# EAGLE schematic BEP32_12nutzen_stencil (EAGLE 6.4), part 3 of 4
## Sheet 9 of 12
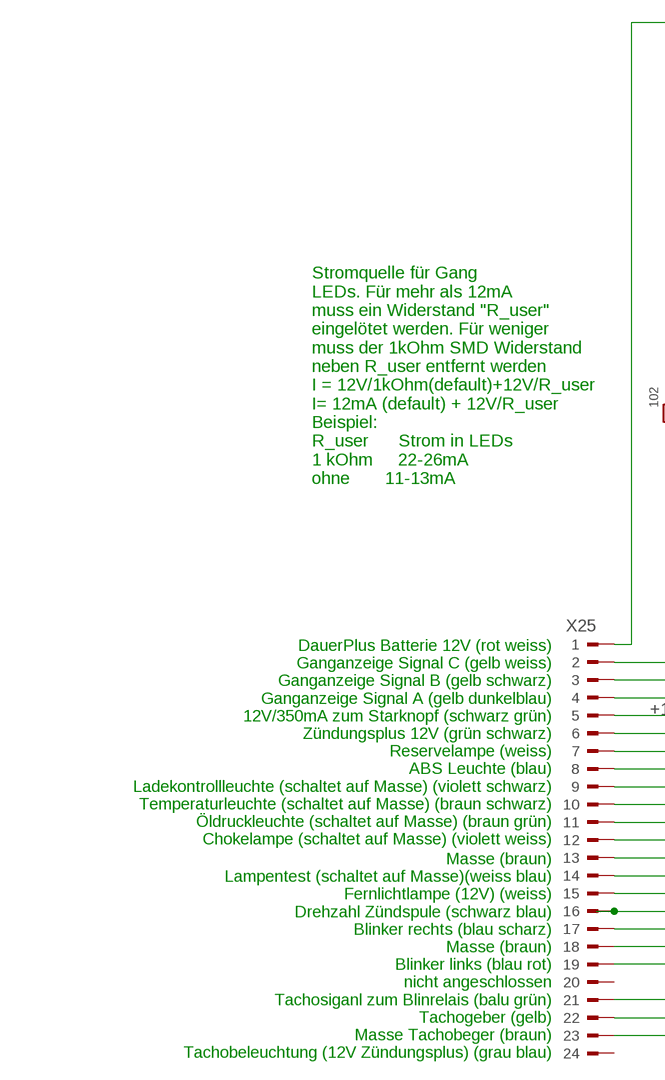
[diagram p16: schematic, sheet 9, part 1 of 2]
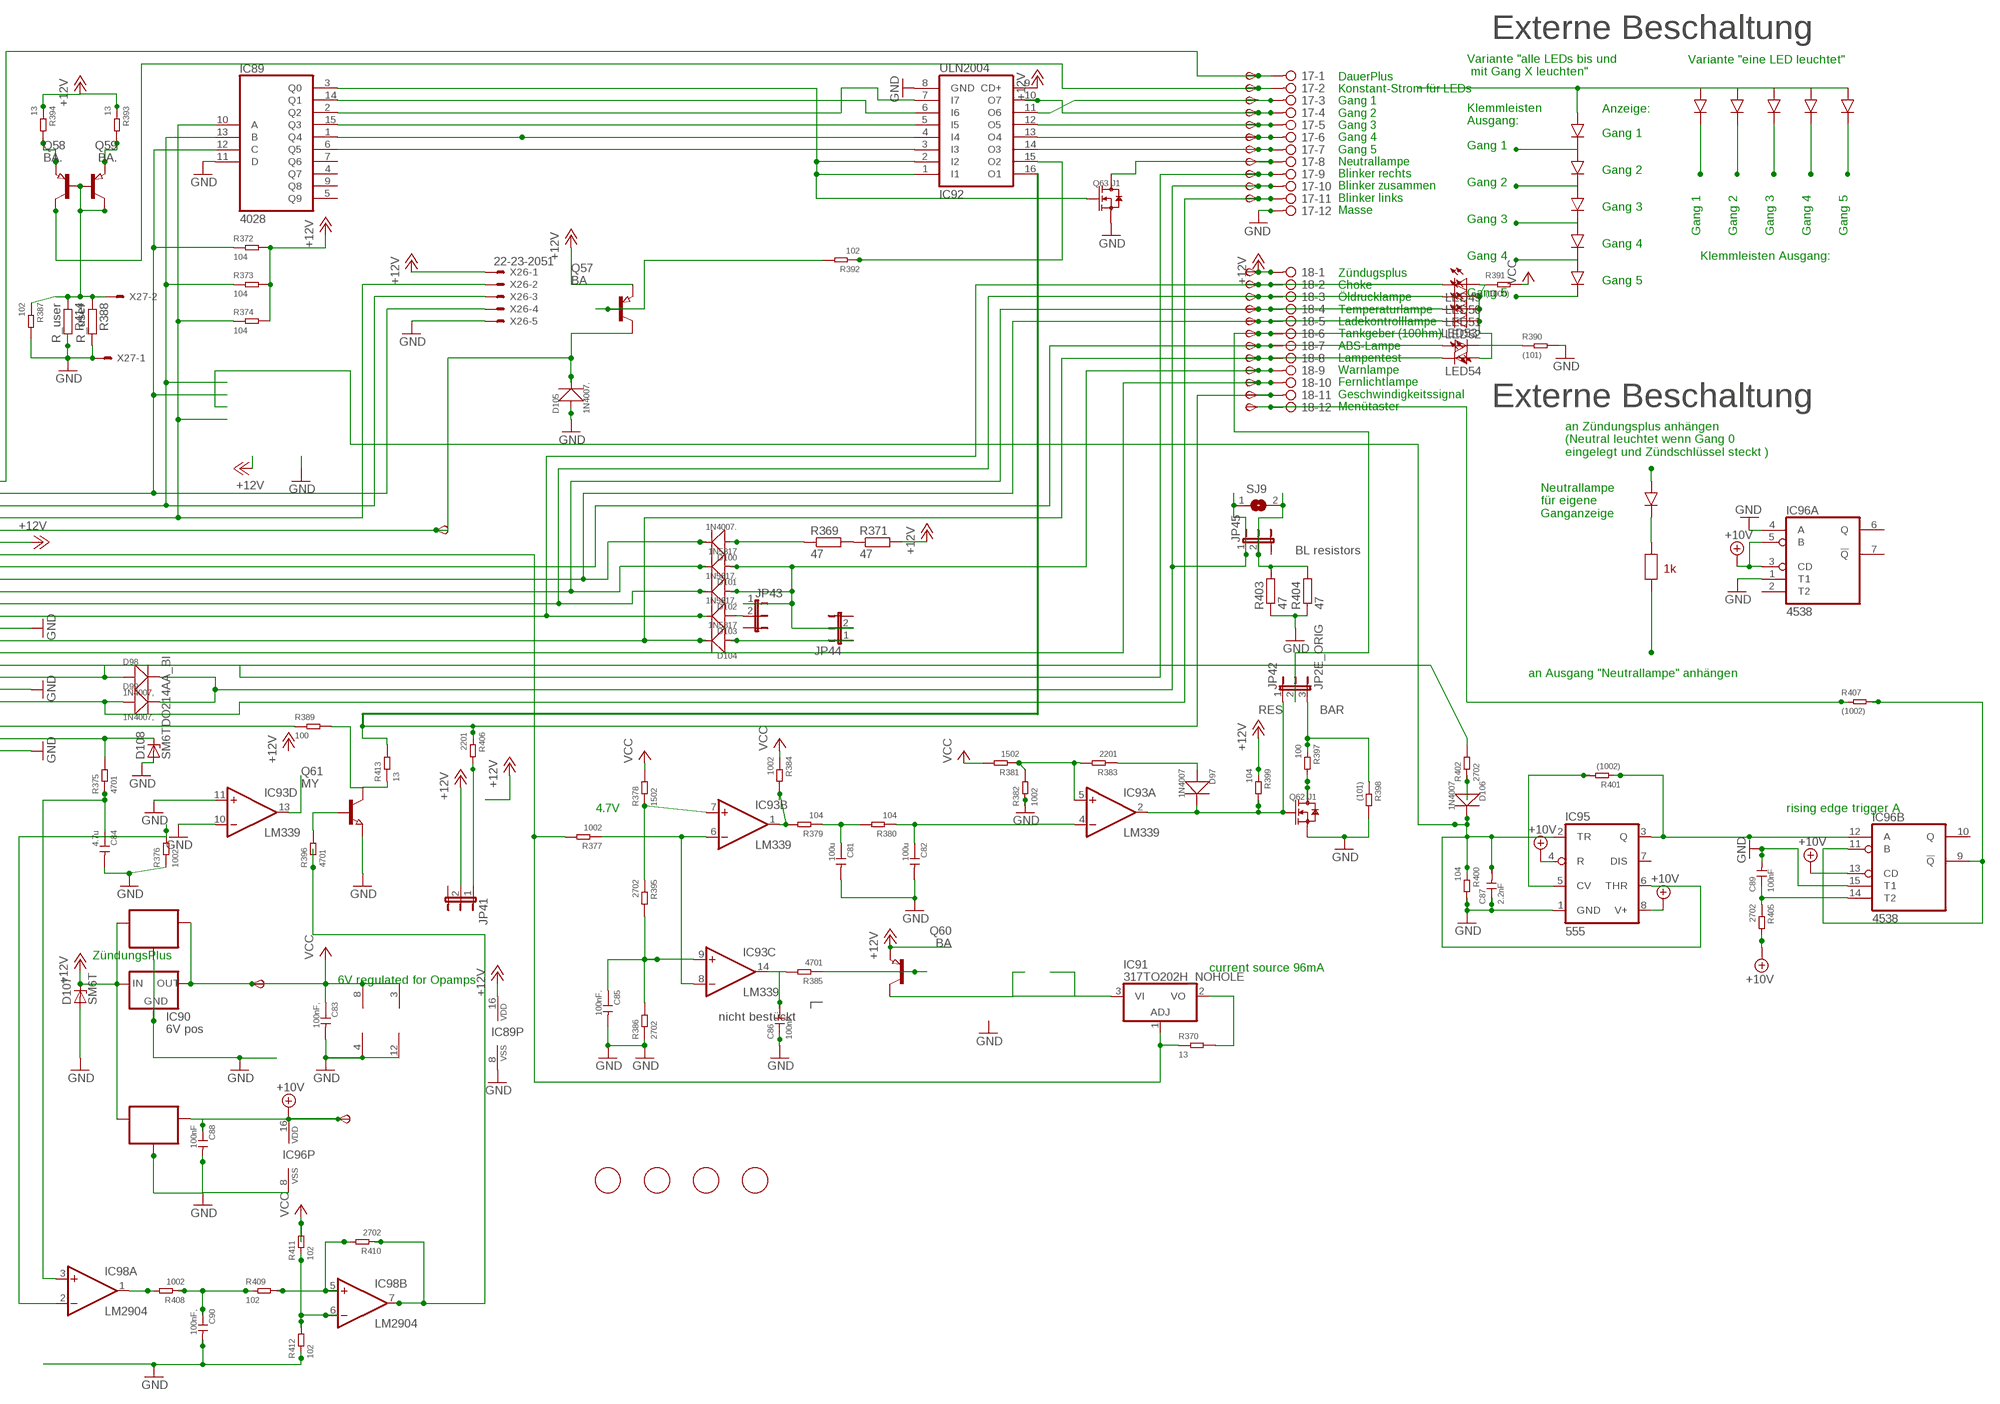
[diagram p17: schematic, sheet 9, part 2 of 2]

### Parts
6V8  TPSB2.0  [B2.0]
10V8  TPSB2.0  [B2.0]
17  2081-1132  [12-PIN]
18  2081-1132  [12-PIN]
C81  100u  CERAMIC-100UF-6.3V-20%-X5R(1206)  [C1206]
C82  100u  CERAMIC-100UF-6.3V-20%-X5R(1206)  [C1206]
C83  100nF,  CERAMIC-100NF-50V-10%-X7R(0805)  [C0805]
C84  4.7u  CERAMIC-4.7UF-25V-10%-X5R(0805)  [C0805]
C85  100nF.  CERAMIC-100NF-50V-10%-X7R(0805)  [C0805]
C86  100nF.  CERAMIC-100NF-50V-10%-X7R(0805)  [C0805]
C87  2.2nF  CERAMIC-100NF-50V-10%-X7R(0805)  [C0805]
C88  100nF  CERAMIC-100NF-50V-10%-X7R(0805)  [C0805]
C89  100nF  CERAMIC-100NF-50V-10%-X7R(0805)  [C0805]
C90  100nF,  CERAMIC-100NF-50V-10%-X7R(0805)  [C0805]
D97  1N4007  DIODE-GEN-PURPOSE-1KV-1A(DO-214AC)  [DO-214AC]
D98  1N4007,  DIODE-GEN-PURPOSE-1KV-1A(DO-214AC)  [DO-214AC]
D99  1N4007,  DIODE-GEN-PURPOSE-1KV-1A(DO-214AC)  [DO-214AC]
D100  1N4007.  DIODE-GEN-PURPOSE-1KV-1A(DO-214AC)  [DO-214AC]
D101  1N5817  DIODE-GEN-PURPOSE-1KV-1A(DO-214AC)DO-214AC/1206  [DO-214AC_SLIM]
D102  1N5817.  DIODE-GEN-PURPOSE-1KV-1A(DO-214AC)DO-214AC/1206  [DO-214AC_SLIM]
D103  1N5817.  DIODE-GEN-PURPOSE-1KV-1A(DO-214AC)DO-214AC/1206  [DO-214AC_SLIM]
D104  1N5817  DIODE-GEN-PURPOSE-1KV-1A(DO-214AC)DO-214AC/1206  [DO-214AC_SLIM]
D105  1N4007.  DIODE-GEN-PURPOSE-1KV-1A(DO-214AC)  [DO-214AC]
D106  1N4007  DIODE-GEN-PURPOSE-1KV-1A(DO-214AC)  [DO-214AC]
D107  SM6T  [DO214AA]
D108  SM6TDO214AA_BI  [DO214AA_BI]
FID33  FIDUCIAL  [FIDUCIAL_1MM]
FID34  FIDUCIAL  [FIDUCIAL_1MM]
FID35  FIDUCIAL  [FIDUCIAL_1MM]
FID36  FIDUCIAL  [FIDUCIAL_1MM]
IC89  4028  4028D  [SO16]
IC90  6V pos  78LXX  [78LXX]
IC91  317TO202H_NOHOLE  [TO220H_NOHOLE]
IC92  ULN2004  ULN2004AD  [SO16]
IC93  LM339  LM339D  [SO14]
IC94  78L06  78LXXSOT89_ROUND  [SOT89_ROUND]
IC95  555  NE555D  [SO08]
IC96  4538  4538D  [SO16]
IC97  78L10  78LXXSOT89_ROUND  [SOT89_ROUND]
IC98  LM2904  LM358D  [SO08]
JP41  JP2EJP2_SMALLPADS  [JP2_SMALLPADS]
JP42  JP2E_ORIG  [JP2_ORIG_SMALLPADS]
JP43  JP2EJP2_SMALLPADS  [JP2_SMALLPADS]
JP44  JP2EJP2_SMALLPADS  [JP2_SMALLPADS]
JP45  JP2EJP2_SMALLPADS  [JP2_SMALLPADS]
LED49  LEDLD260  [LD260]
LED50  LEDLD260  [LD260]
LED51  LEDLD260  [LD260]
LED52  LEDLD260  [LD260]
LED53  LEDLD260  [LD260]
LED54  LEDLD260  [LD260]
Q57  BA  PNP-TRANSISTOR_SOT89  [SOT89]
Q58  BA.  PNP-TRANSISTOR_SOT89  [SOT89]
Q59  BA.  PNP-TRANSISTOR_SOT89  [SOT89]
Q60  BA  PNP-TRANSISTOR_SOT89  [SOT89]
Q61  MY  NPN-TRANSISTOR_SOT89  [SOT89]
Q62  J1  SMD-MOSFET-N-CH-50V-200MA-BSS138W-7-F(SOT-23)  [SOT-23]
Q63  J1  SMD-MOSFET-N-CH-50V-200MA-BSS138W-7-F(SOT-23)  [SOT-23]
R369  47  R-EU_V235/17_1MM  [V235/17_1MM]
R370  13  SMD-RES-13R-5%-1/4W(1206)  [R1206]
R371  47  R-EU_V235/17_1MM  [V235/17_1MM]
R372  104  SMD-RES-10K-1%-1/8W(0805)  [R0805]
R373  104  SMD-RES-10K-1%-1/8W(0805)  [R0805]
R374  104  SMD-RES-10K-1%-1/8W(0805)  [R0805]
R375  4701  SMD-RES-4.7K-5%-1/8W(0805)  [R0805]
R376  1002  SMD-RES-10K-1%-1/8W(0805)  [R0805]
R377  1002  SMD-RES-10K-1%-1/8W(0805)  [R0805]
R378  1502  SMD-RES-10K-1%-1/8W(0805)  [R0805]
R379  104  SMD-RES-10K-1%-1/8W(0805)  [R0805]
R380  104  SMD-RES-10K-1%-1/8W(0805)  [R0805]
R381  1502  SMD-RES-10K-1%-1/8W(0805)  [R0805]
R382  1002  SMD-RES-10K-1%-1/8W(0805)  [R0805]
R383  2201  SMD-RES-2.2K-5%-1/8W(0805)  [R0805]
R384  1002  SMD-RES-10K-1%-1/8W(0805)  [R0805]
R385  4701  SMD-RES-4.7K-5%-1/8W(0805)  [R0805]
R386  2702  SMD-RES-4.7K-5%-1/8W(0805)  [R0805]
R387  102  SMD-RES-1K-5%-1/8W(0805)  [R0805]
R388  R_user  R-EU_R0805  [R0805]
R389  100  SMD-RES-220R-5%-1/8W(0805)  [R0805]
R390  (101)  SMD-RES-100R-5%-1/8W(0805)  [R0805]
R391  (1000)  SMD-RES-100R-5%-1/8W(0805)  [R0805]
R392  102  SMD-RES-1K-5%-1/8W(0805)  [R0805]
R393  13  SMD-RES-13R-5%-1/4W(1206)  [R1206]
R394  13  SMD-RES-13R-5%-1/4W(1206)  [R1206]
R395  2702  SMD-RES-4.7K-5%-1/8W(0805)  [R0805]
R396  4701  SMD-RES-4.7K-5%-1/8W(0805)  [R0805]
R397  100  SMD-RES-2.2K-5%-1/8W(0805)  [R0805]
R398  (101)  SMD-RES-2.2K-5%-1/8W(0805)  [R0805]
R399  104  SMD-RES-10K-1%-1/8W(0805)  [R0805]
R400  104  SMD-RES-10K-1%-1/8W(0805)  [R0805]
R401  (1002)  SMD-RES-10K-1%-1/8W(0805)  [R0805]
R402  2702  SMD-RES-10K-1%-1/8W(0805)  [R0805]
R403  47  R-EU_V235/17_1MM  [V235/17_1MM]
R404  47  R-EU_V235/17_1MM  [V235/17_1MM]
R405  2702  SMD-RES-4.7K-5%-1/8W(0805)  [R0805]
R406  2201  SMD-RES-2.2K-5%-1/8W(0805)  [R0805]
R407  (1002)  SMD-RES-4.7K-5%-1/8W(0805)  [R0805]
R408  1002  SMD-RES-10K-1%-1/8W(0805)  [R0805]
R409  102  SMD-RES-1K-5%-1/8W(0805)  [R0805]
R410  2702  SMD-RES-4.7K-5%-1/8W(0805)  [R0805]
R411  102  SMD-RES-1K-5%-1/8W(0805)  [R0805]
R412  102  SMD-RES-1K-5%-1/8W(0805)  [R0805]
R413  13  SMD-RES-13R-5%-1/4W(1206)  [R1206]
R414  R_user  R-EU_R0805  [R0805]
SJ9  SJ  [SJ]
START8  TPSB2.0  [B2.0]
TP185  TPSB2.0  [B2.0]
TP186  TPSB2.0  [B2.0]
TP187  TPSB2.0  [B2.0]
TP188  TPSB2.0  [B2.0]
TP189  TPSB2.0  [B2.0]
TP190  TPSB2.0  [B2.0]
TP191  TPSB2.0  [B2.0]
TP192  TPSB2.0  [B2.0]
TP193  TPSB2.0  [B2.0]
TP194  TPSB2.0  [B2.0]
TP195  TPSB2.0  [B2.0]
TP196  TPSB2.0  [B2.0]
TP197  TPSB2.0  [B2.0]
TP198  TPSB2.0  [B2.0]
TP199  TPSB2.0  [B2.0]
TP200  TPSB2.0  [B2.0]
TP201  TPSB2.0  [B2.0]
TP202  TPSB2.0  [B2.0]
TP203  TPSB1,27  [B1,27]
TP204  TPSB2.0  [B2.0]
TP205  TPSB2.0  [B2.0]
TP206  TPSB2.0  [B2.0]
TP207  TPSB2.0  [B2.0]
X25  CON_BMWV2  [24-PIN_V2]
X26  22-23-2051  [22-23-2051]
X27  22-23-2021  [22-23-2021]

### Nets
+10V: 10V8.TP(PP) C88.1 IC95.4(R) IC95.8(V+) IC96.3(A:CD) IC96.5(A:B) IC96.13(B:CD) IC96.16(P:VDD) IC97.1(OUT) R405.2 ; also sheet 1,2,3,4,5,6,7,8,10,11,12
+12V: 18.1 D107.C IC89.16(VDD) IC90.IN IC92.9(CD+) IC94.3(IN) IC97.3(IN) JP41.2 Q57.3(E) Q60.3(E) R371.2 R372.2 R373.2 R374.2 R393.1 R394.1 R399.1 TP206.TP(PP) X25.6 X26.1 ; also sheet 1,2,3,4,5,6,7,8,10,11,12
+12V9: IC98.7(B:OUT) R396.1 R410.1
GND: 17.12 C81.2 C82.2 C83.2 C84.2 C85.2 C86.1 C87.1 C88.2 C89.2 C90.2 D105.1(+) D107.A D108.A IC89.8(VSS) IC89.11(D) IC90.GND IC92.8(GND) IC93.10(D:-IN) IC93.11(D:+IN) IC93.12(P:GND) IC94.2(GND) IC94.2@1(GND) IC95.1(GND) IC96.1(A:T1) IC96.4(A:A) IC96.8(P:VSS) IC96.15(B:T1) IC97.2(GND) IC97.2@1(GND) IC98.4(P:V-) Q61.3(E) Q62.2(S) Q63.2(S) R376.1 R382.1 R386.1 R387.2 R388.2 R390.2 R398.2 R400.2 R403.1 R404.1 R412.1 R414.2 X25.13 X25.18 X25.23 X26.5 X27.1 ; also sheet 1,2,3,4,5,6,7,8,10,11,12
N$779: R369.2 R371.1
N$780: 18.9 D101.1(+) D102.1(+) JP43.1 JP44.2 TP203.TP(PP)
N$781: IC89.10(A) R374.1 X25.4 X26.2
N$782: IC89.13(B) R373.1 X25.3 X26.3
N$783: D105.2(-) Q57.2(C) START8.TP(PP) X25.5
N$784: IC89.12(C) R372.1 X25.2 X26.4
N$785: 18.7 LED53.A TP201.TP(PP) X25.8
N$786: 18.2 D103.2(-) LED49.K(C) TP196.TP(PP) X25.12
N$787: 18.3 D102.2(-) LED50.K(C) TP197.TP(PP) X25.11
N$788: 18.4 D101.2(-) LED51.K(C) TP198.TP(PP) X25.10
N$789: 18.8 D104.2(-) LED54.K(C) TP202.TP(PP) X25.14
N$790: 17.9 D98.1(+) TP193.TP(PP) X25.17
N$791: 17.11 D99.1(+) TP195.TP(PP) X25.19
N$792: D108.C R375.2 X25.22
N$793: C84.1 IC98.3(A:+IN) R375.1
N$794: 18.11 IC92.16(O1) R406.1 R413.2 TP205.TP(PP)
N$795: IC93.1(B:OUT) R379.2 R384.2
N$796: C81.1 R379.1 R380.2
N$797: C82.1 IC93.4(A:-IN) R380.1
N$798: IC93.5(A:+IN) R381.1 R382.2 R383.2
N$799: D97.1(+) R383.1
N$800: C85.1 IC93.9(C:+IN) R386.2 R395.2
N$801: C86.2 IC93.14(C:OUT) R385.2
N$802: Q60.1(B) R385.1
N$803: IC89.2(Q2) IC92.7(I7)
N$804: 17.5 IC92.12(O5) TP189.TP(PP)
N$805: IC89.1(Q4) IC92.4(I4)
N$806: 17.8 Q63.3(D) TP192.TP(PP)
N$807: 18.10 TP204.TP(PP) X25.15
N$808: 18.5 D100.2(-) LED52.K(C) TP199.TP(PP) X25.9
N$809: D100.1(+) R369.1
N$810: IC89.6(Q5) IC92.3(I3)
N$811: 17.4 IC92.10(O7) TP188.TP(PP)
N$812: IC91.1(ADJ) R370.1 R377.2 X25.7
N$813: IC93.6(B:-IN) IC93.8(C:-IN) R377.1
N$814: 17.2 Q59.2(C) TP186.TP(PP)
N$815: 17.1 TP185.TP(PP) X25.1
N$829: R402.2 X25.16
N$830: IC89.15(Q3) IC92.5(I5)
N$831: 17.6 IC92.13(O4) TP190.TP(PP)
N$832: 17.7 IC92.14(O3) TP191.TP(PP)
N$833: 18.6 JP42.2 TP200.TP(PP)
N$834: LED53.K(C) R390.1
N$835: LED49.A LED50.A LED51.A LED52.A LED54.A R391.1
N$836: Q57.1(B) R392.2
N$837: IC89.3(Q0) IC92.1(I1) IC92.2(I2) Q63.1(G)
N$838: IC89.14(Q1) IC92.6(I6)
N$839: 17.3 IC92.11(O6) TP187.TP(PP)
N$840: Q58.1(B) Q58.2(C) Q59.1(B) R387.1 R388.1 R414.1 X27.2
N$841: Q59.3(E) R394.2
N$842: Q58.3(E) R393.2
N$843: IC93.7(B:+IN) R378.1 R395.1
N$844: IC98.2(A:-IN) R376.2
N$845: Q61.1(B) R396.2
N$846: Q62.3(D) R397.2
N$847: IC91.2(VO) R370.2
N$848: IC91.3(VI) Q60.2(C)
N$849: C87.2 D106.2(-) IC95.2(TR) IC95.6(THR) R400.1
N$850: IC95.5(CV) R401.2
N$851: IC95.3(Q) IC96.12(B:A) R401.1
N$852: D106.1(+) R402.1
N$853: 17.10 D98.2(-) D99.2(-) JP45.1 SJ9.1 TP194.TP(PP)
N$854: JP45.2 R403.2 R404.2 SJ9.2
N$855: IC96.9(B:!Q) IC96.11(B:B) R407.2
N$856: C89.1 IC96.14(B:T2) R405.1
N$857: JP41.1 R406.2
N$858: IC92.15(O2) R392.1
N$859: 18.12 R407.1 TP207.TP(PP)
N$860: D103.1(+) JP43.2
N$861: D97.2(-) IC93.2(A:OUT) JP42.1 Q62.1(G) R399.2
N$862: IC98.1(A:OUT) R408.2
N$863: C90.1 R408.1 R409.1
N$864: IC98.5(B:+IN) R409.2 R410.2
N$865: IC98.6(B:-IN) R411.1 R412.2
N$866: D104.1(+) JP44.1
N$867: JP42.3 R397.1 R398.1
N$868: IC93.13(D:OUT)
N$869: R389.1 X25.21
N$870: Q61.2(C) R389.2 R413.1
VCC: 6V8.TP(PP) C83.1 IC90.OUT IC93.3(P:V+) IC94.1(OUT) IC98.8(P:V+) R378.2 R381.2 R384.1 R391.2 R411.2 ; also sheet 1,2,3,4,5,6,7,8,10,11,12
Unconnected: IC89.4(Q7) IC89.5(Q9) IC89.7(Q6) IC89.9(Q8) IC95.7(DIS) IC96.2(A:T2) IC96.6(A:Q) IC96.7(A:!Q) IC96.10(B:Q) X25.20 X25.24

### Notes on the sheet
- Externe Beschaltung
- Variante "eine LED leuchtet"
- Variante "alle LEDs bis und
   mit Gang X leuchten"
- Anzeige:
- Klemmleisten
  Ausgang:
- Gang 1
- DauerPlus
  Konstant-Strom für LEDs
  Gang 1
  Gang 2
  Gang 3
  Gang 4
  Gang 5
  Neutrallampe
  Blinker rechts
  Blinker zusammen
  Blinker links
  Masse
- Gang 1
- Gang 2
- Gang 2
- Gang 3
- Gang 3
- Gang 1 | Gang 2 | Gang 3 | Gang 4 | Gang 5
- Gang 4
- Gang 4 | Klemmleisten Ausgang:
- Gang 5
- Gang 5
- Zündugsplus
  Choke
  Öldrucklampe
  Temperaturlampe
  Ladekontrolllampe
  Tankgeber (100hm)
  ABS-Lampe
  Lampentest
  Warnlampe
  Fernlichtlampe
  Geschwindigkeitssignal
  Menütaster
- Stromquelle für Gang
  LEDs. Für mehr als 12mA
  muss ein Widerstand "R_user"
  eingelötet werden. Für weniger
  muss der 1kOhm SMD Widerstand
  neben R_user entfernt werden
  I = 12V/1kOhm(default)+12V/R_user
  I= 12mA (default) + 12V/R_user
  Beispiel:
  R_user      Strom in LEDs
  1 kOhm     22-26mA
  ohne       11-13mA
- Externe Beschaltung
- an Zündungsplus anhängen
  (Neutral leuchtet wenn Gang 0
  eingelegt und Zündschlüssel steckt )
- Neutrallampe
  für eigene
  Ganganzeige
- DauerPlus Batterie 12V (rot weiss)
  Ganganzeige Signal C (gelb weiss)
  Ganganzeige Signal B (gelb schwarz)
  Ganganzeige Signal A (gelb dunkelblau)
  12V/350mA zum Starknopf (schwarz grün)
  Zündungsplus 12V (grün schwarz)
  Reservelampe (weiss)
  ABS Leuchte (blau)
  Ladekontrollleuchte (schaltet auf Masse) (violett schwarz)
  Temperaturleuchte (schaltet auf Masse) (braun schwarz)
  Öldruckleuchte (schaltet auf Masse) (braun grün)
  Chokelampe (schaltet auf Masse) (violett weiss)
- BL resistors
- 1k
- an Ausgang "Neutrallampe" anhängen
- Masse (braun)
  Lampentest (schaltet auf Masse)(weiss blau)
  Fernlichtlampe (12V) (weiss)
  Drehzahl Zündspule (schwarz blau)
  Blinker rechts (blau scharz)
  Masse (braun)
  Blinker links (blau rot)
  nicht angeschlossen
  Tachosiganl zum Blinrelais (balu grün)
  Tachogeber (gelb)
  Masse Tachobeger (braun)
  Tachobeleuchtung (12V Zündungsplus) (grau blau)
- RES | BAR
- 4.7V | rising edge trigger A
- ZündungsPlus
- current source 96mA
- 6V regulated for Opamps
- nicht bestückt

## Sheet 10 of 12
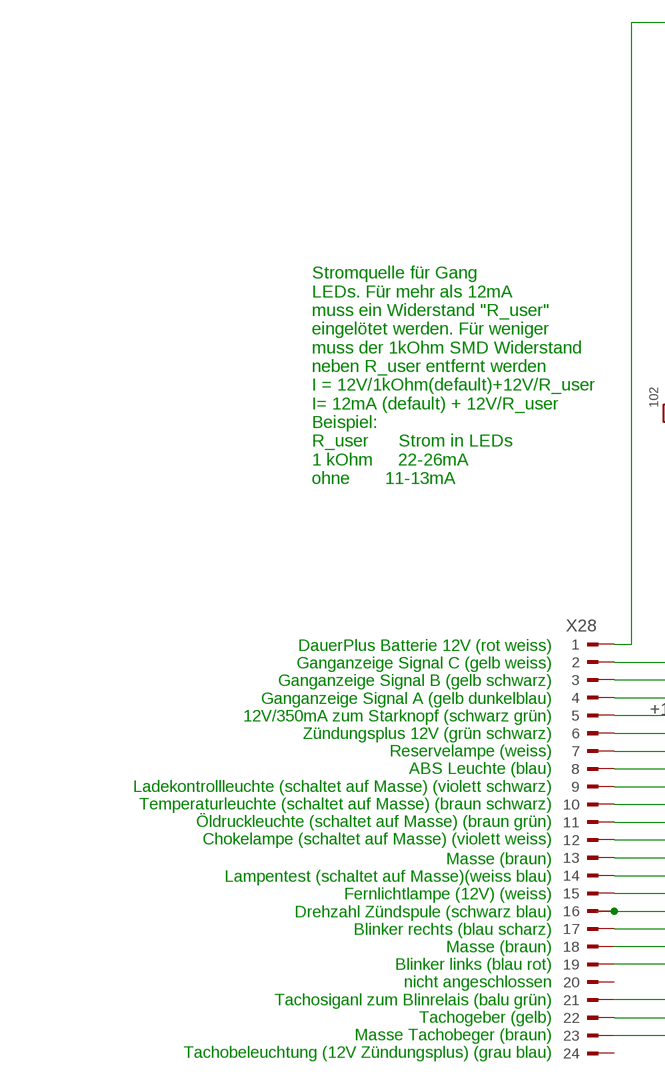
[diagram p18: schematic, sheet 10, part 1 of 2]
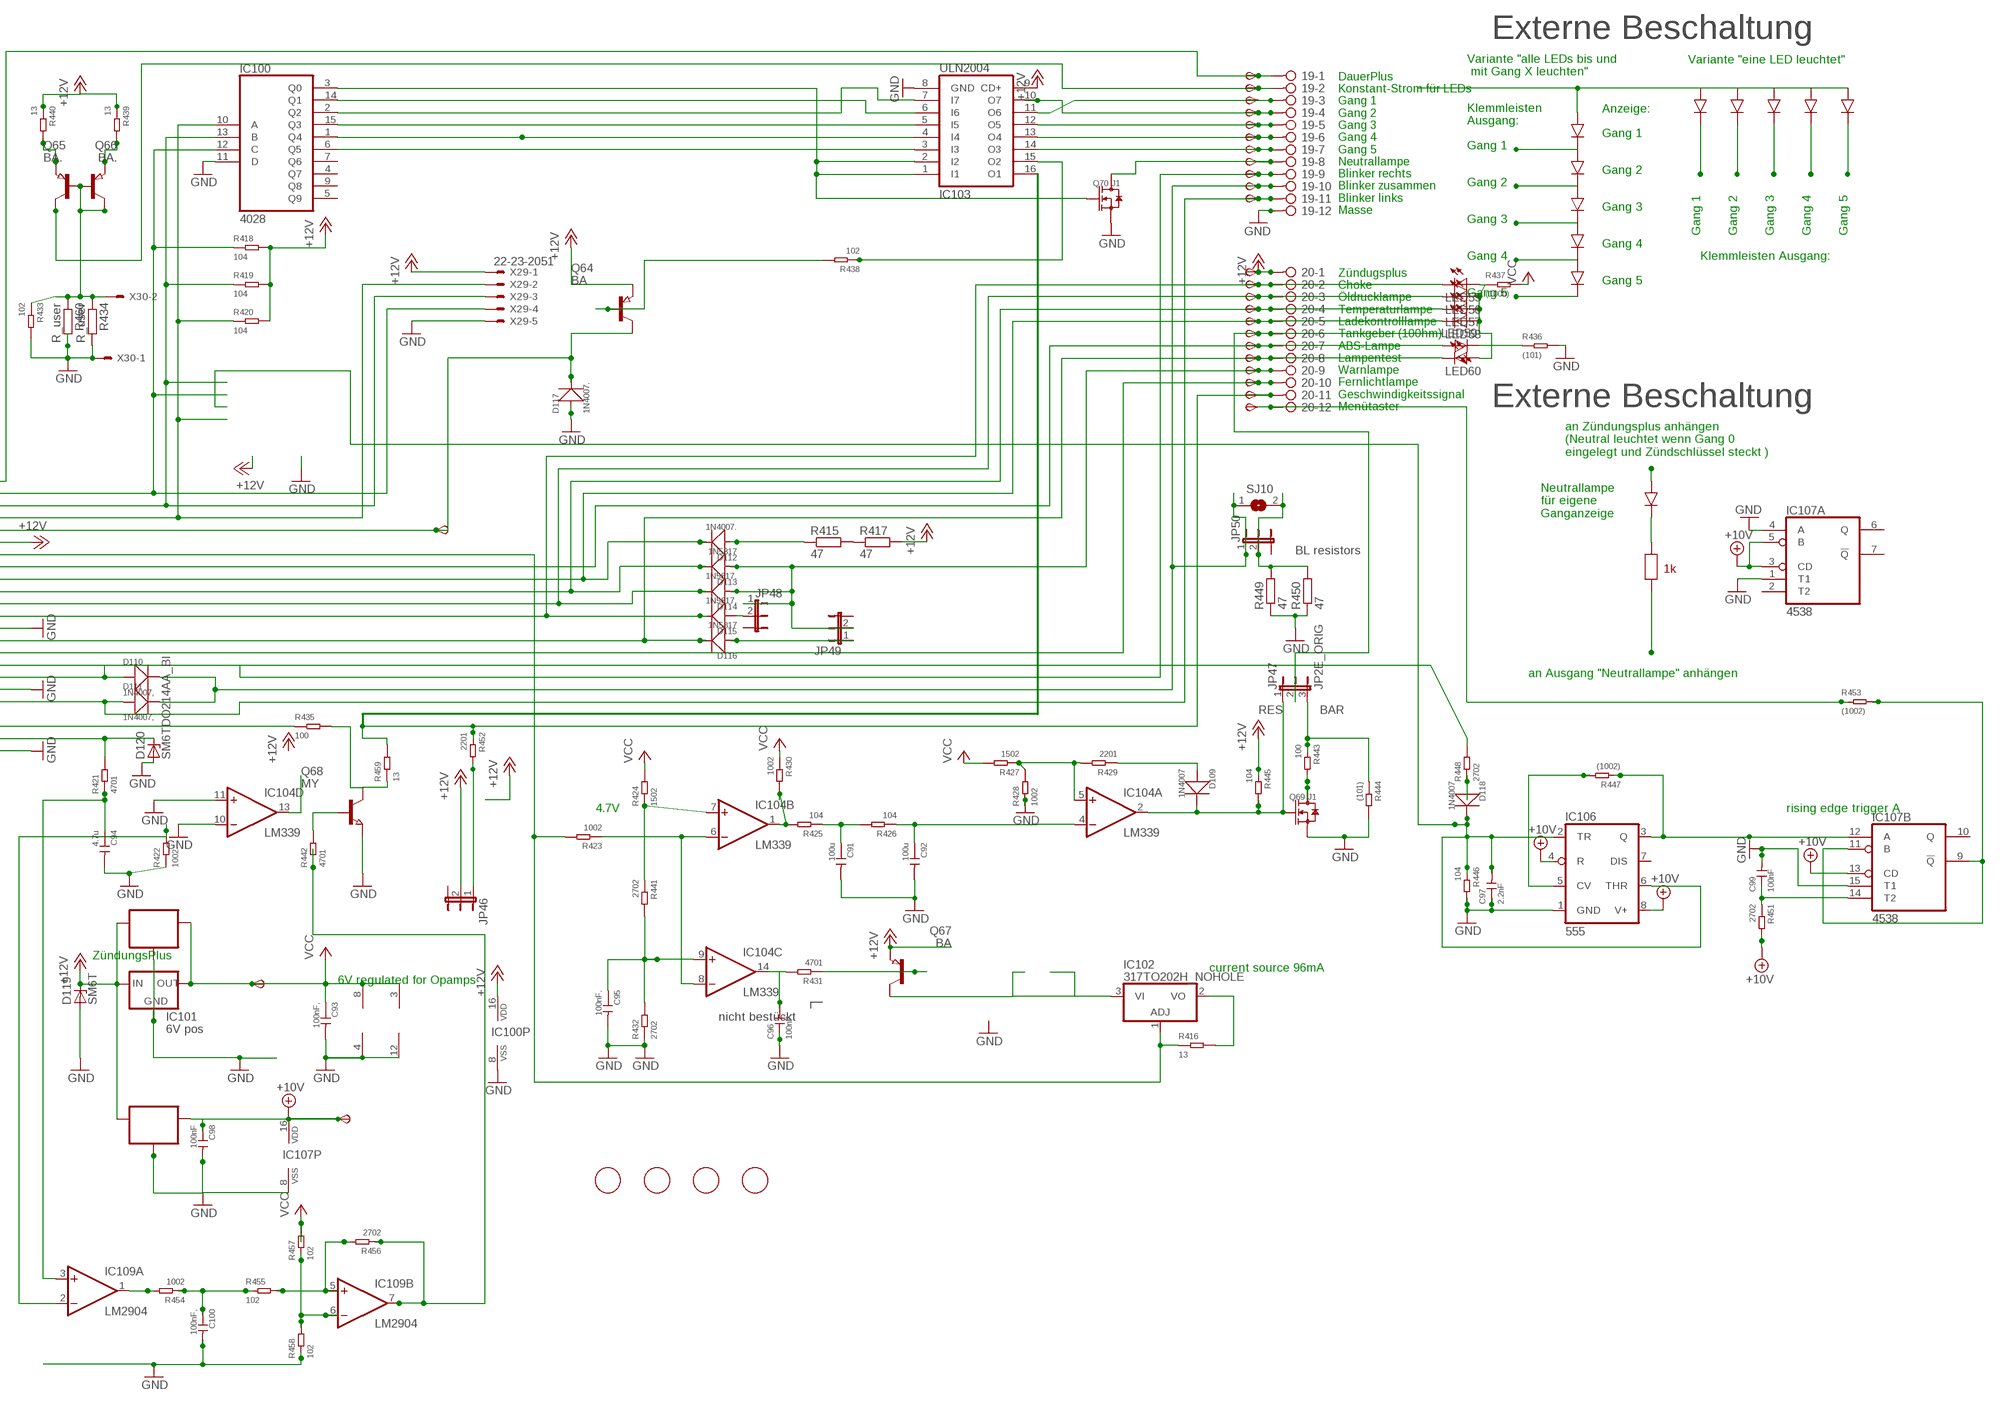
[diagram p19: schematic, sheet 10, part 2 of 2]

### Parts
6V9  TPSB2.0  [B2.0]
10V9  TPSB2.0  [B2.0]
19  2081-1132  [12-PIN]
20  2081-1132  [12-PIN]
C91  100u  CERAMIC-100UF-6.3V-20%-X5R(1206)  [C1206]
C92  100u  CERAMIC-100UF-6.3V-20%-X5R(1206)  [C1206]
C93  100nF,  CERAMIC-100NF-50V-10%-X7R(0805)  [C0805]
C94  4.7u  CERAMIC-4.7UF-25V-10%-X5R(0805)  [C0805]
C95  100nF.  CERAMIC-100NF-50V-10%-X7R(0805)  [C0805]
C96  100nF.  CERAMIC-100NF-50V-10%-X7R(0805)  [C0805]
C97  2.2nF  CERAMIC-100NF-50V-10%-X7R(0805)  [C0805]
C98  100nF  CERAMIC-100NF-50V-10%-X7R(0805)  [C0805]
C99  100nF  CERAMIC-100NF-50V-10%-X7R(0805)  [C0805]
C100  100nF,  CERAMIC-100NF-50V-10%-X7R(0805)  [C0805]
D109  1N4007  DIODE-GEN-PURPOSE-1KV-1A(DO-214AC)  [DO-214AC]
D110  1N4007,  DIODE-GEN-PURPOSE-1KV-1A(DO-214AC)  [DO-214AC]
D111  1N4007,  DIODE-GEN-PURPOSE-1KV-1A(DO-214AC)  [DO-214AC]
D112  1N4007.  DIODE-GEN-PURPOSE-1KV-1A(DO-214AC)  [DO-214AC]
D113  1N5817  DIODE-GEN-PURPOSE-1KV-1A(DO-214AC)DO-214AC/1206  [DO-214AC_SLIM]
D114  1N5817.  DIODE-GEN-PURPOSE-1KV-1A(DO-214AC)DO-214AC/1206  [DO-214AC_SLIM]
D115  1N5817.  DIODE-GEN-PURPOSE-1KV-1A(DO-214AC)DO-214AC/1206  [DO-214AC_SLIM]
D116  1N5817  DIODE-GEN-PURPOSE-1KV-1A(DO-214AC)DO-214AC/1206  [DO-214AC_SLIM]
D117  1N4007.  DIODE-GEN-PURPOSE-1KV-1A(DO-214AC)  [DO-214AC]
D118  1N4007  DIODE-GEN-PURPOSE-1KV-1A(DO-214AC)  [DO-214AC]
D119  SM6T  [DO214AA]
D120  SM6TDO214AA_BI  [DO214AA_BI]
FID37  FIDUCIAL  [FIDUCIAL_1MM]
FID38  FIDUCIAL  [FIDUCIAL_1MM]
FID39  FIDUCIAL  [FIDUCIAL_1MM]
FID40  FIDUCIAL  [FIDUCIAL_1MM]
IC100  4028  4028D  [SO16]
IC101  6V pos  78LXX  [78LXX]
IC102  317TO202H_NOHOLE  [TO220H_NOHOLE]
IC103  ULN2004  ULN2004AD  [SO16]
IC104  LM339  LM339D  [SO14]
IC105  78L06  78LXXSOT89_ROUND  [SOT89_ROUND]
IC106  555  NE555D  [SO08]
IC107  4538  4538D  [SO16]
IC108  78L10  78LXXSOT89_ROUND  [SOT89_ROUND]
IC109  LM2904  LM358D  [SO08]
JP46  JP2EJP2_SMALLPADS  [JP2_SMALLPADS]
JP47  JP2E_ORIG  [JP2_ORIG_SMALLPADS]
JP48  JP2EJP2_SMALLPADS  [JP2_SMALLPADS]
JP49  JP2EJP2_SMALLPADS  [JP2_SMALLPADS]
JP50  JP2EJP2_SMALLPADS  [JP2_SMALLPADS]
LED55  LEDLD260  [LD260]
LED56  LEDLD260  [LD260]
LED57  LEDLD260  [LD260]
LED58  LEDLD260  [LD260]
LED59  LEDLD260  [LD260]
LED60  LEDLD260  [LD260]
Q64  BA  PNP-TRANSISTOR_SOT89  [SOT89]
Q65  BA.  PNP-TRANSISTOR_SOT89  [SOT89]
Q66  BA.  PNP-TRANSISTOR_SOT89  [SOT89]
Q67  BA  PNP-TRANSISTOR_SOT89  [SOT89]
Q68  MY  NPN-TRANSISTOR_SOT89  [SOT89]
Q69  J1  SMD-MOSFET-N-CH-50V-200MA-BSS138W-7-F(SOT-23)  [SOT-23]
Q70  J1  SMD-MOSFET-N-CH-50V-200MA-BSS138W-7-F(SOT-23)  [SOT-23]
R415  47  R-EU_V235/17_1MM  [V235/17_1MM]
R416  13  SMD-RES-13R-5%-1/4W(1206)  [R1206]
R417  47  R-EU_V235/17_1MM  [V235/17_1MM]
R418  104  SMD-RES-10K-1%-1/8W(0805)  [R0805]
R419  104  SMD-RES-10K-1%-1/8W(0805)  [R0805]
R420  104  SMD-RES-10K-1%-1/8W(0805)  [R0805]
R421  4701  SMD-RES-4.7K-5%-1/8W(0805)  [R0805]
R422  1002  SMD-RES-10K-1%-1/8W(0805)  [R0805]
R423  1002  SMD-RES-10K-1%-1/8W(0805)  [R0805]
R424  1502  SMD-RES-10K-1%-1/8W(0805)  [R0805]
R425  104  SMD-RES-10K-1%-1/8W(0805)  [R0805]
R426  104  SMD-RES-10K-1%-1/8W(0805)  [R0805]
R427  1502  SMD-RES-10K-1%-1/8W(0805)  [R0805]
R428  1002  SMD-RES-10K-1%-1/8W(0805)  [R0805]
R429  2201  SMD-RES-2.2K-5%-1/8W(0805)  [R0805]
R430  1002  SMD-RES-10K-1%-1/8W(0805)  [R0805]
R431  4701  SMD-RES-4.7K-5%-1/8W(0805)  [R0805]
R432  2702  SMD-RES-4.7K-5%-1/8W(0805)  [R0805]
R433  102  SMD-RES-1K-5%-1/8W(0805)  [R0805]
R434  R_user  R-EU_R0805  [R0805]
R435  100  SMD-RES-220R-5%-1/8W(0805)  [R0805]
R436  (101)  SMD-RES-100R-5%-1/8W(0805)  [R0805]
R437  (1000)  SMD-RES-100R-5%-1/8W(0805)  [R0805]
R438  102  SMD-RES-1K-5%-1/8W(0805)  [R0805]
R439  13  SMD-RES-13R-5%-1/4W(1206)  [R1206]
R440  13  SMD-RES-13R-5%-1/4W(1206)  [R1206]
R441  2702  SMD-RES-4.7K-5%-1/8W(0805)  [R0805]
R442  4701  SMD-RES-4.7K-5%-1/8W(0805)  [R0805]
R443  100  SMD-RES-2.2K-5%-1/8W(0805)  [R0805]
R444  (101)  SMD-RES-2.2K-5%-1/8W(0805)  [R0805]
R445  104  SMD-RES-10K-1%-1/8W(0805)  [R0805]
R446  104  SMD-RES-10K-1%-1/8W(0805)  [R0805]
R447  (1002)  SMD-RES-10K-1%-1/8W(0805)  [R0805]
R448  2702  SMD-RES-10K-1%-1/8W(0805)  [R0805]
R449  47  R-EU_V235/17_1MM  [V235/17_1MM]
R450  47  R-EU_V235/17_1MM  [V235/17_1MM]
R451  2702  SMD-RES-4.7K-5%-1/8W(0805)  [R0805]
R452  2201  SMD-RES-2.2K-5%-1/8W(0805)  [R0805]
R453  (1002)  SMD-RES-4.7K-5%-1/8W(0805)  [R0805]
R454  1002  SMD-RES-10K-1%-1/8W(0805)  [R0805]
R455  102  SMD-RES-1K-5%-1/8W(0805)  [R0805]
R456  2702  SMD-RES-4.7K-5%-1/8W(0805)  [R0805]
R457  102  SMD-RES-1K-5%-1/8W(0805)  [R0805]
R458  102  SMD-RES-1K-5%-1/8W(0805)  [R0805]
R459  13  SMD-RES-13R-5%-1/4W(1206)  [R1206]
R460  R_user  R-EU_R0805  [R0805]
SJ10  SJ  [SJ]
START9  TPSB2.0  [B2.0]
TP208  TPSB2.0  [B2.0]
TP209  TPSB2.0  [B2.0]
TP210  TPSB2.0  [B2.0]
TP211  TPSB2.0  [B2.0]
TP212  TPSB2.0  [B2.0]
TP213  TPSB2.0  [B2.0]
TP214  TPSB2.0  [B2.0]
TP215  TPSB2.0  [B2.0]
TP216  TPSB2.0  [B2.0]
TP217  TPSB2.0  [B2.0]
TP218  TPSB2.0  [B2.0]
TP219  TPSB2.0  [B2.0]
TP220  TPSB2.0  [B2.0]
TP221  TPSB2.0  [B2.0]
TP222  TPSB2.0  [B2.0]
TP223  TPSB2.0  [B2.0]
TP224  TPSB2.0  [B2.0]
TP225  TPSB2.0  [B2.0]
TP226  TPSB1,27  [B1,27]
TP227  TPSB2.0  [B2.0]
TP228  TPSB2.0  [B2.0]
TP229  TPSB2.0  [B2.0]
TP230  TPSB2.0  [B2.0]
X28  CON_BMWV2  [24-PIN_V2]
X29  22-23-2051  [22-23-2051]
X30  22-23-2021  [22-23-2021]

### Nets
+10V: 10V9.TP(PP) C98.1 IC106.4(R) IC106.8(V+) IC107.3(A:CD) IC107.5(A:B) IC107.13(B:CD) IC107.16(P:VDD) IC108.1(OUT) R451.2 ; also sheet 1,2,3,4,5,6,7,8,9,11,12
+12V: 20.1 D119.C IC100.16(VDD) IC101.IN IC103.9(CD+) IC105.3(IN) IC108.3(IN) JP46.2 Q64.3(E) Q67.3(E) R417.2 R418.2 R419.2 R420.2 R439.1 R440.1 R445.1 TP229.TP(PP) X28.6 X29.1 ; also sheet 1,2,3,4,5,6,7,8,9,11,12
+12V10: IC109.7(B:OUT) R442.1 R456.1
GND: 19.12 C91.2 C92.2 C93.2 C94.2 C95.2 C96.1 C97.1 C98.2 C99.2 C100.2 D117.1(+) D119.A D120.A IC100.8(VSS) IC100.11(D) IC101.GND IC103.8(GND) IC104.10(D:-IN) IC104.11(D:+IN) IC104.12(P:GND) IC105.2(GND) IC105.2@1(GND) IC106.1(GND) IC107.1(A:T1) IC107.4(A:A) IC107.8(P:VSS) IC107.15(B:T1) IC108.2(GND) IC108.2@1(GND) IC109.4(P:V-) Q68.3(E) Q69.2(S) Q70.2(S) R422.1 R428.1 R432.1 R433.2 R434.2 R436.2 R444.2 R446.2 R449.1 R450.1 R458.1 R460.2 X28.13 X28.18 X28.23 X29.5 X30.1 ; also sheet 1,2,3,4,5,6,7,8,9,11,12
N$892: R415.2 R417.1
N$893: 20.9 D113.1(+) D114.1(+) JP48.1 JP49.2 TP226.TP(PP)
N$894: IC100.10(A) R420.1 X28.4 X29.2
N$895: IC100.13(B) R419.1 X28.3 X29.3
N$896: D117.2(-) Q64.2(C) START9.TP(PP) X28.5
N$897: IC100.12(C) R418.1 X28.2 X29.4
N$898: 20.7 LED59.A TP224.TP(PP) X28.8
N$899: 20.2 D115.2(-) LED55.K(C) TP219.TP(PP) X28.12
N$900: 20.3 D114.2(-) LED56.K(C) TP220.TP(PP) X28.11
N$901: 20.4 D113.2(-) LED57.K(C) TP221.TP(PP) X28.10
N$902: 20.8 D116.2(-) LED60.K(C) TP225.TP(PP) X28.14
N$903: 19.9 D110.1(+) TP216.TP(PP) X28.17
N$904: 19.11 D111.1(+) TP218.TP(PP) X28.19
N$905: D120.C R421.2 X28.22
N$906: C94.1 IC109.3(A:+IN) R421.1
N$907: 20.11 IC103.16(O1) R452.1 R459.2 TP228.TP(PP)
N$908: IC104.1(B:OUT) R425.2 R430.2
N$909: C91.1 R425.1 R426.2
N$910: C92.1 IC104.4(A:-IN) R426.1
N$911: IC104.5(A:+IN) R427.1 R428.2 R429.2
N$912: D109.1(+) R429.1
N$913: C95.1 IC104.9(C:+IN) R432.2 R441.2
N$914: C96.2 IC104.14(C:OUT) R431.2
N$915: Q67.1(B) R431.1
N$916: IC100.2(Q2) IC103.7(I7)
N$917: 19.5 IC103.12(O5) TP212.TP(PP)
N$918: IC100.1(Q4) IC103.4(I4)
N$919: 19.8 Q70.3(D) TP215.TP(PP)
N$920: 20.10 TP227.TP(PP) X28.15
N$921: 20.5 D112.2(-) LED58.K(C) TP222.TP(PP) X28.9
N$922: D112.1(+) R415.1
N$923: IC100.6(Q5) IC103.3(I3)
N$924: 19.4 IC103.10(O7) TP211.TP(PP)
N$925: IC102.1(ADJ) R416.1 R423.2 X28.7
N$926: IC104.6(B:-IN) IC104.8(C:-IN) R423.1
N$927: 19.2 Q66.2(C) TP209.TP(PP)
N$928: 19.1 TP208.TP(PP) X28.1
N$942: R448.2 X28.16
N$943: IC100.15(Q3) IC103.5(I5)
N$944: 19.6 IC103.13(O4) TP213.TP(PP)
N$945: 19.7 IC103.14(O3) TP214.TP(PP)
N$946: 20.6 JP47.2 TP223.TP(PP)
N$947: LED59.K(C) R436.1
N$948: LED55.A LED56.A LED57.A LED58.A LED60.A R437.1
N$949: Q64.1(B) R438.2
N$950: IC100.3(Q0) IC103.1(I1) IC103.2(I2) Q70.1(G)
N$951: IC100.14(Q1) IC103.6(I6)
N$952: 19.3 IC103.11(O6) TP210.TP(PP)
N$953: Q65.1(B) Q65.2(C) Q66.1(B) R433.1 R434.1 R460.1 X30.2
N$954: Q66.3(E) R440.2
N$955: Q65.3(E) R439.2
N$956: IC104.7(B:+IN) R424.1 R441.1
N$957: IC109.2(A:-IN) R422.2
N$958: Q68.1(B) R442.2
N$959: Q69.3(D) R443.2
N$960: IC102.2(VO) R416.2
N$961: IC102.3(VI) Q67.2(C)
N$962: C97.2 D118.2(-) IC106.2(TR) IC106.6(THR) R446.1
N$963: IC106.5(CV) R447.2
N$964: IC106.3(Q) IC107.12(B:A) R447.1
N$965: D118.1(+) R448.1
N$966: 19.10 D110.2(-) D111.2(-) JP50.1 SJ10.1 TP217.TP(PP)
N$967: JP50.2 R449.2 R450.2 SJ10.2
N$968: IC107.9(B:!Q) IC107.11(B:B) R453.2
N$969: C99.1 IC107.14(B:T2) R451.1
N$970: JP46.1 R452.2
N$971: IC103.15(O2) R438.1
N$972: 20.12 R453.1 TP230.TP(PP)
N$973: D115.1(+) JP48.2
N$974: D109.2(-) IC104.2(A:OUT) JP47.1 Q69.1(G) R445.2
N$975: IC109.1(A:OUT) R454.2
N$976: C100.1 R454.1 R455.1
N$977: IC109.5(B:+IN) R455.2 R456.2
N$978: IC109.6(B:-IN) R457.1 R458.2
N$979: D116.1(+) JP49.1
N$980: JP47.3 R443.1 R444.1
N$981: IC104.13(D:OUT)
N$982: R435.1 X28.21
N$983: Q68.2(C) R435.2 R459.1
VCC: 6V9.TP(PP) C93.1 IC101.OUT IC104.3(P:V+) IC105.1(OUT) IC109.8(P:V+) R424.2 R427.2 R430.1 R437.2 R457.2 ; also sheet 1,2,3,4,5,6,7,8,9,11,12
Unconnected: IC100.4(Q7) IC100.5(Q9) IC100.7(Q6) IC100.9(Q8) IC106.7(DIS) IC107.2(A:T2) IC107.6(A:Q) IC107.7(A:!Q) IC107.10(B:Q) X28.20 X28.24

### Notes on the sheet
- Externe Beschaltung
- Variante "eine LED leuchtet"
- Variante "alle LEDs bis und
   mit Gang X leuchten"
- Anzeige:
- Klemmleisten
  Ausgang:
- Gang 1
- DauerPlus
  Konstant-Strom für LEDs
  Gang 1
  Gang 2
  Gang 3
  Gang 4
  Gang 5
  Neutrallampe
  Blinker rechts
  Blinker zusammen
  Blinker links
  Masse
- Gang 1
- Gang 2
- Gang 2
- Gang 3
- Gang 3
- Gang 1 | Gang 2 | Gang 3 | Gang 4 | Gang 5
- Gang 4
- Gang 4 | Klemmleisten Ausgang:
- Gang 5
- Gang 5
- Zündugsplus
  Choke
  Öldrucklampe
  Temperaturlampe
  Ladekontrolllampe
  Tankgeber (100hm)
  ABS-Lampe
  Lampentest
  Warnlampe
  Fernlichtlampe
  Geschwindigkeitssignal
  Menütaster
- Stromquelle für Gang
  LEDs. Für mehr als 12mA
  muss ein Widerstand "R_user"
  eingelötet werden. Für weniger
  muss der 1kOhm SMD Widerstand
  neben R_user entfernt werden
  I = 12V/1kOhm(default)+12V/R_user
  I= 12mA (default) + 12V/R_user
  Beispiel:
  R_user      Strom in LEDs
  1 kOhm     22-26mA
  ohne       11-13mA
- Externe Beschaltung
- an Zündungsplus anhängen
  (Neutral leuchtet wenn Gang 0
  eingelegt und Zündschlüssel steckt )
- Neutrallampe
  für eigene
  Ganganzeige
- DauerPlus Batterie 12V (rot weiss)
  Ganganzeige Signal C (gelb weiss)
  Ganganzeige Signal B (gelb schwarz)
  Ganganzeige Signal A (gelb dunkelblau)
  12V/350mA zum Starknopf (schwarz grün)
  Zündungsplus 12V (grün schwarz)
  Reservelampe (weiss)
  ABS Leuchte (blau)
  Ladekontrollleuchte (schaltet auf Masse) (violett schwarz)
  Temperaturleuchte (schaltet auf Masse) (braun schwarz)
  Öldruckleuchte (schaltet auf Masse) (braun grün)
  Chokelampe (schaltet auf Masse) (violett weiss)
- BL resistors
- 1k
- an Ausgang "Neutrallampe" anhängen
- Masse (braun)
  Lampentest (schaltet auf Masse)(weiss blau)
  Fernlichtlampe (12V) (weiss)
  Drehzahl Zündspule (schwarz blau)
  Blinker rechts (blau scharz)
  Masse (braun)
  Blinker links (blau rot)
  nicht angeschlossen
  Tachosiganl zum Blinrelais (balu grün)
  Tachogeber (gelb)
  Masse Tachobeger (braun)
  Tachobeleuchtung (12V Zündungsplus) (grau blau)
- RES | BAR
- 4.7V | rising edge trigger A
- ZündungsPlus
- current source 96mA
- 6V regulated for Opamps
- nicht bestückt

## Sheet 11 of 12
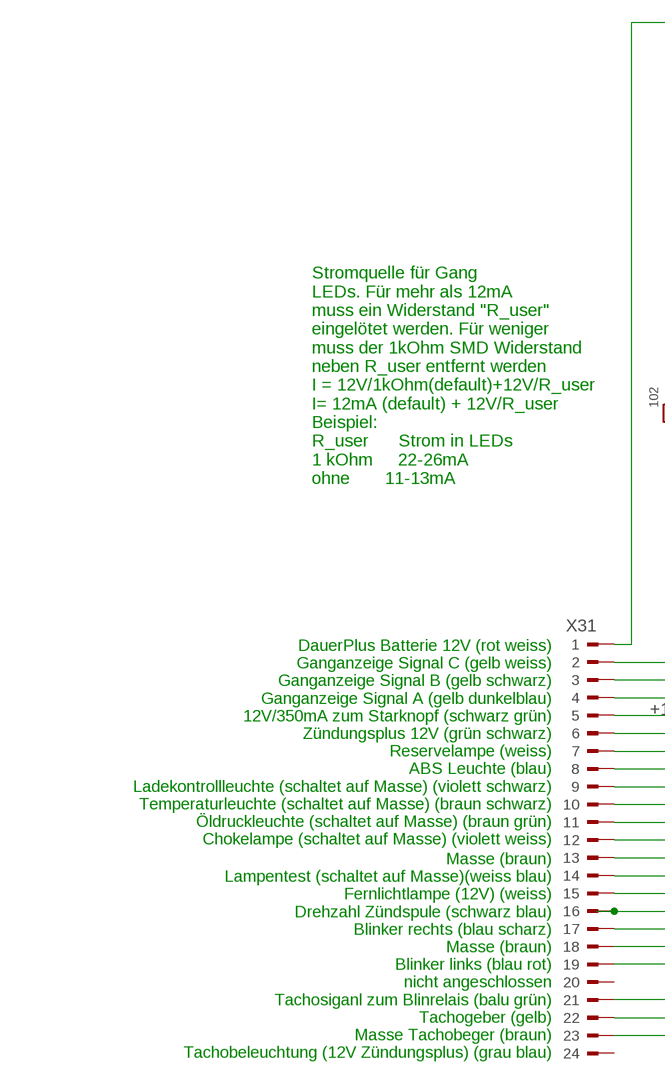
[diagram p20: schematic, sheet 11, part 1 of 2]
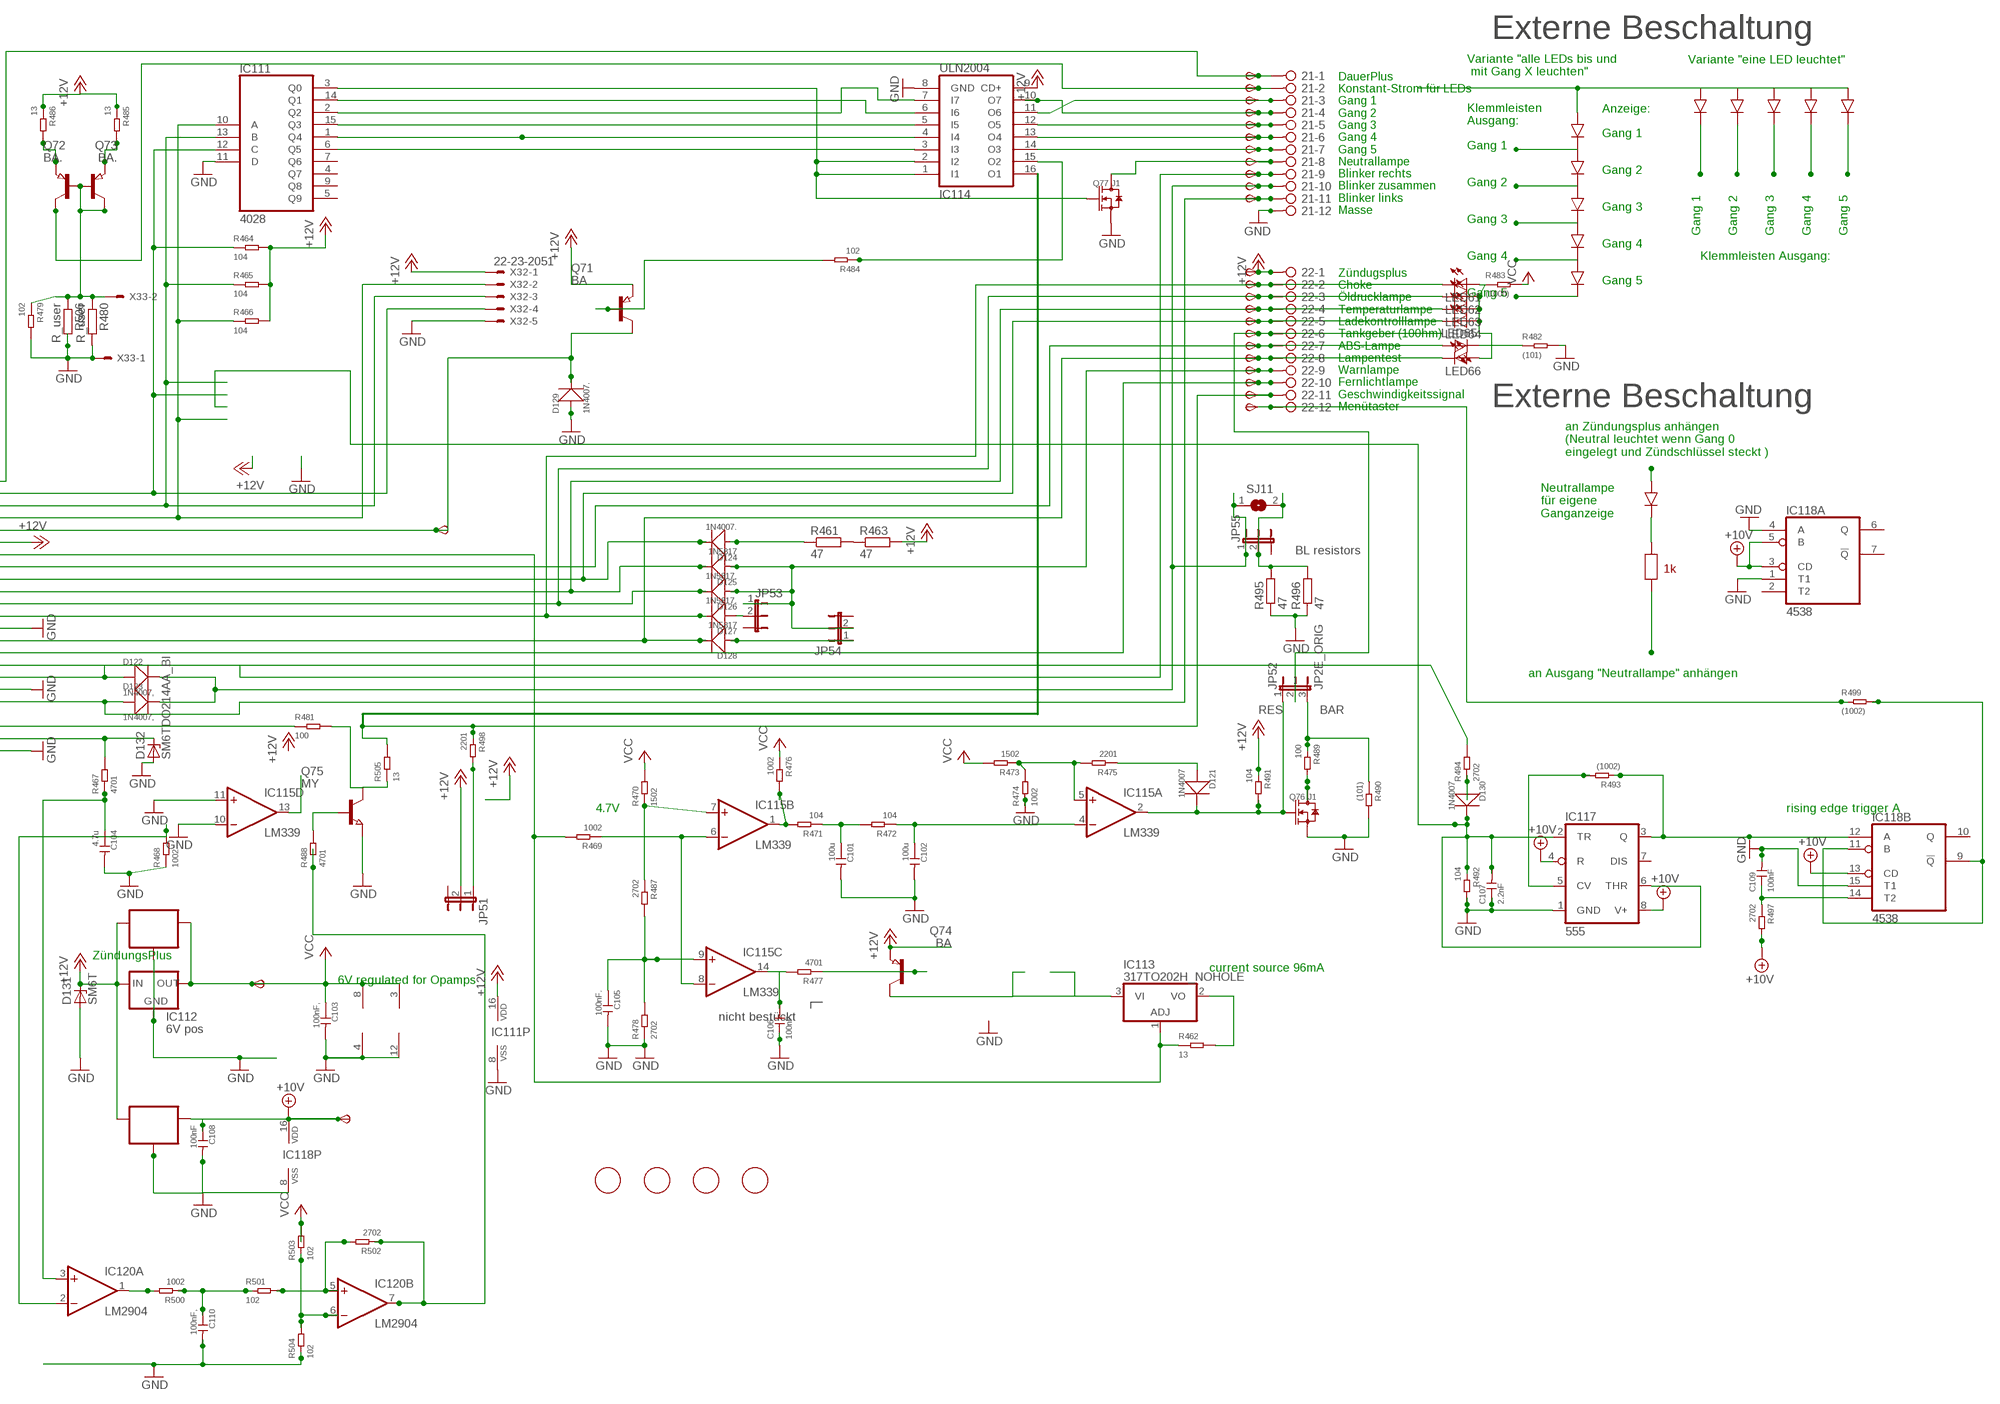
[diagram p21: schematic, sheet 11, part 2 of 2]

### Parts
6V10  TPSB2.0  [B2.0]
10V10  TPSB2.0  [B2.0]
21  2081-1132  [12-PIN]
22  2081-1132  [12-PIN]
C101  100u  CERAMIC-100UF-6.3V-20%-X5R(1206)  [C1206]
C102  100u  CERAMIC-100UF-6.3V-20%-X5R(1206)  [C1206]
C103  100nF,  CERAMIC-100NF-50V-10%-X7R(0805)  [C0805]
C104  4.7u  CERAMIC-4.7UF-25V-10%-X5R(0805)  [C0805]
C105  100nF.  CERAMIC-100NF-50V-10%-X7R(0805)  [C0805]
C106  100nF.  CERAMIC-100NF-50V-10%-X7R(0805)  [C0805]
C107  2.2nF  CERAMIC-100NF-50V-10%-X7R(0805)  [C0805]
C108  100nF  CERAMIC-100NF-50V-10%-X7R(0805)  [C0805]
C109  100nF  CERAMIC-100NF-50V-10%-X7R(0805)  [C0805]
C110  100nF,  CERAMIC-100NF-50V-10%-X7R(0805)  [C0805]
D121  1N4007  DIODE-GEN-PURPOSE-1KV-1A(DO-214AC)  [DO-214AC]
D122  1N4007,  DIODE-GEN-PURPOSE-1KV-1A(DO-214AC)  [DO-214AC]
D123  1N4007,  DIODE-GEN-PURPOSE-1KV-1A(DO-214AC)  [DO-214AC]
D124  1N4007.  DIODE-GEN-PURPOSE-1KV-1A(DO-214AC)  [DO-214AC]
D125  1N5817  DIODE-GEN-PURPOSE-1KV-1A(DO-214AC)DO-214AC/1206  [DO-214AC_SLIM]
D126  1N5817.  DIODE-GEN-PURPOSE-1KV-1A(DO-214AC)DO-214AC/1206  [DO-214AC_SLIM]
D127  1N5817.  DIODE-GEN-PURPOSE-1KV-1A(DO-214AC)DO-214AC/1206  [DO-214AC_SLIM]
D128  1N5817  DIODE-GEN-PURPOSE-1KV-1A(DO-214AC)DO-214AC/1206  [DO-214AC_SLIM]
D129  1N4007.  DIODE-GEN-PURPOSE-1KV-1A(DO-214AC)  [DO-214AC]
D130  1N4007  DIODE-GEN-PURPOSE-1KV-1A(DO-214AC)  [DO-214AC]
D131  SM6T  [DO214AA]
D132  SM6TDO214AA_BI  [DO214AA_BI]
FID41  FIDUCIAL  [FIDUCIAL_1MM]
FID42  FIDUCIAL  [FIDUCIAL_1MM]
FID43  FIDUCIAL  [FIDUCIAL_1MM]
FID44  FIDUCIAL  [FIDUCIAL_1MM]
IC111  4028  4028D  [SO16]
IC112  6V pos  78LXX  [78LXX]
IC113  317TO202H_NOHOLE  [TO220H_NOHOLE]
IC114  ULN2004  ULN2004AD  [SO16]
IC115  LM339  LM339D  [SO14]
IC116  78L06  78LXXSOT89_ROUND  [SOT89_ROUND]
IC117  555  NE555D  [SO08]
IC118  4538  4538D  [SO16]
IC119  78L10  78LXXSOT89_ROUND  [SOT89_ROUND]
IC120  LM2904  LM358D  [SO08]
JP51  JP2EJP2_SMALLPADS  [JP2_SMALLPADS]
JP52  JP2E_ORIG  [JP2_ORIG_SMALLPADS]
JP53  JP2EJP2_SMALLPADS  [JP2_SMALLPADS]
JP54  JP2EJP2_SMALLPADS  [JP2_SMALLPADS]
JP55  JP2EJP2_SMALLPADS  [JP2_SMALLPADS]
LED61  LEDLD260  [LD260]
LED62  LEDLD260  [LD260]
LED63  LEDLD260  [LD260]
LED64  LEDLD260  [LD260]
LED65  LEDLD260  [LD260]
LED66  LEDLD260  [LD260]
Q71  BA  PNP-TRANSISTOR_SOT89  [SOT89]
Q72  BA.  PNP-TRANSISTOR_SOT89  [SOT89]
Q73  BA.  PNP-TRANSISTOR_SOT89  [SOT89]
Q74  BA  PNP-TRANSISTOR_SOT89  [SOT89]
Q75  MY  NPN-TRANSISTOR_SOT89  [SOT89]
Q76  J1  SMD-MOSFET-N-CH-50V-200MA-BSS138W-7-F(SOT-23)  [SOT-23]
Q77  J1  SMD-MOSFET-N-CH-50V-200MA-BSS138W-7-F(SOT-23)  [SOT-23]
R461  47  R-EU_V235/17_1MM  [V235/17_1MM]
R462  13  SMD-RES-13R-5%-1/4W(1206)  [R1206]
R463  47  R-EU_V235/17_1MM  [V235/17_1MM]
R464  104  SMD-RES-10K-1%-1/8W(0805)  [R0805]
R465  104  SMD-RES-10K-1%-1/8W(0805)  [R0805]
R466  104  SMD-RES-10K-1%-1/8W(0805)  [R0805]
R467  4701  SMD-RES-4.7K-5%-1/8W(0805)  [R0805]
R468  1002  SMD-RES-10K-1%-1/8W(0805)  [R0805]
R469  1002  SMD-RES-10K-1%-1/8W(0805)  [R0805]
R470  1502  SMD-RES-10K-1%-1/8W(0805)  [R0805]
R471  104  SMD-RES-10K-1%-1/8W(0805)  [R0805]
R472  104  SMD-RES-10K-1%-1/8W(0805)  [R0805]
R473  1502  SMD-RES-10K-1%-1/8W(0805)  [R0805]
R474  1002  SMD-RES-10K-1%-1/8W(0805)  [R0805]
R475  2201  SMD-RES-2.2K-5%-1/8W(0805)  [R0805]
R476  1002  SMD-RES-10K-1%-1/8W(0805)  [R0805]
R477  4701  SMD-RES-4.7K-5%-1/8W(0805)  [R0805]
R478  2702  SMD-RES-4.7K-5%-1/8W(0805)  [R0805]
R479  102  SMD-RES-1K-5%-1/8W(0805)  [R0805]
R480  R_user  R-EU_R0805  [R0805]
R481  100  SMD-RES-220R-5%-1/8W(0805)  [R0805]
R482  (101)  SMD-RES-100R-5%-1/8W(0805)  [R0805]
R483  (1000)  SMD-RES-100R-5%-1/8W(0805)  [R0805]
R484  102  SMD-RES-1K-5%-1/8W(0805)  [R0805]
R485  13  SMD-RES-13R-5%-1/4W(1206)  [R1206]
R486  13  SMD-RES-13R-5%-1/4W(1206)  [R1206]
R487  2702  SMD-RES-4.7K-5%-1/8W(0805)  [R0805]
R488  4701  SMD-RES-4.7K-5%-1/8W(0805)  [R0805]
R489  100  SMD-RES-2.2K-5%-1/8W(0805)  [R0805]
R490  (101)  SMD-RES-2.2K-5%-1/8W(0805)  [R0805]
R491  104  SMD-RES-10K-1%-1/8W(0805)  [R0805]
R492  104  SMD-RES-10K-1%-1/8W(0805)  [R0805]
R493  (1002)  SMD-RES-10K-1%-1/8W(0805)  [R0805]
R494  2702  SMD-RES-10K-1%-1/8W(0805)  [R0805]
R495  47  R-EU_V235/17_1MM  [V235/17_1MM]
R496  47  R-EU_V235/17_1MM  [V235/17_1MM]
R497  2702  SMD-RES-4.7K-5%-1/8W(0805)  [R0805]
R498  2201  SMD-RES-2.2K-5%-1/8W(0805)  [R0805]
R499  (1002)  SMD-RES-4.7K-5%-1/8W(0805)  [R0805]
R500  1002  SMD-RES-10K-1%-1/8W(0805)  [R0805]
R501  102  SMD-RES-1K-5%-1/8W(0805)  [R0805]
R502  2702  SMD-RES-4.7K-5%-1/8W(0805)  [R0805]
R503  102  SMD-RES-1K-5%-1/8W(0805)  [R0805]
R504  102  SMD-RES-1K-5%-1/8W(0805)  [R0805]
R505  13  SMD-RES-13R-5%-1/4W(1206)  [R1206]
R506  R_user  R-EU_R0805  [R0805]
SJ11  SJ  [SJ]
START10  TPSB2.0  [B2.0]
TP231  TPSB2.0  [B2.0]
TP232  TPSB2.0  [B2.0]
TP233  TPSB2.0  [B2.0]
TP234  TPSB2.0  [B2.0]
TP235  TPSB2.0  [B2.0]
TP236  TPSB2.0  [B2.0]
TP237  TPSB2.0  [B2.0]
TP238  TPSB2.0  [B2.0]
TP239  TPSB2.0  [B2.0]
TP240  TPSB2.0  [B2.0]
TP241  TPSB2.0  [B2.0]
TP242  TPSB2.0  [B2.0]
TP243  TPSB2.0  [B2.0]
TP244  TPSB2.0  [B2.0]
TP245  TPSB2.0  [B2.0]
TP246  TPSB2.0  [B2.0]
TP247  TPSB2.0  [B2.0]
TP248  TPSB2.0  [B2.0]
TP249  TPSB1,27  [B1,27]
TP250  TPSB2.0  [B2.0]
TP251  TPSB2.0  [B2.0]
TP252  TPSB2.0  [B2.0]
TP253  TPSB2.0  [B2.0]
X31  CON_BMWV2  [24-PIN_V2]
X32  22-23-2051  [22-23-2051]
X33  22-23-2021  [22-23-2021]

### Nets
+10V: 10V10.TP(PP) C108.1 IC117.4(R) IC117.8(V+) IC118.3(A:CD) IC118.5(A:B) IC118.13(B:CD) IC118.16(P:VDD) IC119.1(OUT) R497.2 ; also sheet 1,2,3,4,5,6,7,8,9,10,12
+12V: 22.1 D131.C IC111.16(VDD) IC112.IN IC114.9(CD+) IC116.3(IN) IC119.3(IN) JP51.2 Q71.3(E) Q74.3(E) R463.2 R464.2 R465.2 R466.2 R485.1 R486.1 R491.1 TP252.TP(PP) X31.6 X32.1 ; also sheet 1,2,3,4,5,6,7,8,9,10,12
+12V11: IC120.7(B:OUT) R488.1 R502.1
GND: 21.12 C101.2 C102.2 C103.2 C104.2 C105.2 C106.1 C107.1 C108.2 C109.2 C110.2 D129.1(+) D131.A D132.A IC111.8(VSS) IC111.11(D) IC112.GND IC114.8(GND) IC115.10(D:-IN) IC115.11(D:+IN) IC115.12(P:GND) IC116.2(GND) IC116.2@1(GND) IC117.1(GND) IC118.1(A:T1) IC118.4(A:A) IC118.8(P:VSS) IC118.15(B:T1) IC119.2(GND) IC119.2@1(GND) IC120.4(P:V-) Q75.3(E) Q76.2(S) Q77.2(S) R468.1 R474.1 R478.1 R479.2 R480.2 R482.2 R490.2 R492.2 R495.1 R496.1 R504.1 R506.2 X31.13 X31.18 X31.23 X32.5 X33.1 ; also sheet 1,2,3,4,5,6,7,8,9,10,12
N$984: R461.2 R463.1
N$985: 22.9 D125.1(+) D126.1(+) JP53.1 JP54.2 TP249.TP(PP)
N$986: IC111.10(A) R466.1 X31.4 X32.2
N$987: IC111.13(B) R465.1 X31.3 X32.3
N$988: D129.2(-) Q71.2(C) START10.TP(PP) X31.5
N$989: IC111.12(C) R464.1 X31.2 X32.4
N$990: 22.7 LED65.A TP247.TP(PP) X31.8
N$991: 22.2 D127.2(-) LED61.K(C) TP242.TP(PP) X31.12
N$992: 22.3 D126.2(-) LED62.K(C) TP243.TP(PP) X31.11
N$993: 22.4 D125.2(-) LED63.K(C) TP244.TP(PP) X31.10
N$994: 22.8 D128.2(-) LED66.K(C) TP248.TP(PP) X31.14
N$995: 21.9 D122.1(+) TP239.TP(PP) X31.17
N$996: 21.11 D123.1(+) TP241.TP(PP) X31.19
N$997: D132.C R467.2 X31.22
N$998: C104.1 IC120.3(A:+IN) R467.1
N$999: 22.11 IC114.16(O1) R498.1 R505.2 TP251.TP(PP)
N$1000: IC115.1(B:OUT) R471.2 R476.2
N$1001: C101.1 R471.1 R472.2
N$1002: C102.1 IC115.4(A:-IN) R472.1
N$1003: IC115.5(A:+IN) R473.1 R474.2 R475.2
N$1004: D121.1(+) R475.1
N$1005: C105.1 IC115.9(C:+IN) R478.2 R487.2
N$1006: C106.2 IC115.14(C:OUT) R477.2
N$1007: Q74.1(B) R477.1
N$1008: IC111.2(Q2) IC114.7(I7)
N$1009: 21.5 IC114.12(O5) TP235.TP(PP)
N$1010: IC111.1(Q4) IC114.4(I4)
N$1011: 21.8 Q77.3(D) TP238.TP(PP)
N$1012: 22.10 TP250.TP(PP) X31.15
N$1013: 22.5 D124.2(-) LED64.K(C) TP245.TP(PP) X31.9
N$1014: D124.1(+) R461.1
N$1015: IC111.6(Q5) IC114.3(I3)
N$1016: 21.4 IC114.10(O7) TP234.TP(PP)
N$1017: IC113.1(ADJ) R462.1 R469.2 X31.7
N$1018: IC115.6(B:-IN) IC115.8(C:-IN) R469.1
N$1019: 21.2 Q73.2(C) TP232.TP(PP)
N$1020: 21.1 TP231.TP(PP) X31.1
N$1034: R494.2 X31.16
N$1035: IC111.15(Q3) IC114.5(I5)
N$1036: 21.6 IC114.13(O4) TP236.TP(PP)
N$1037: 21.7 IC114.14(O3) TP237.TP(PP)
N$1038: 22.6 JP52.2 TP246.TP(PP)
N$1039: LED65.K(C) R482.1
N$1040: LED61.A LED62.A LED63.A LED64.A LED66.A R483.1
N$1041: Q71.1(B) R484.2
N$1042: IC111.3(Q0) IC114.1(I1) IC114.2(I2) Q77.1(G)
N$1043: IC111.14(Q1) IC114.6(I6)
N$1044: 21.3 IC114.11(O6) TP233.TP(PP)
N$1045: Q72.1(B) Q72.2(C) Q73.1(B) R479.1 R480.1 R506.1 X33.2
N$1046: Q73.3(E) R486.2
N$1047: Q72.3(E) R485.2
N$1048: IC115.7(B:+IN) R470.1 R487.1
N$1049: IC120.2(A:-IN) R468.2
N$1050: Q75.1(B) R488.2
N$1051: Q76.3(D) R489.2
N$1052: IC113.2(VO) R462.2
N$1053: IC113.3(VI) Q74.2(C)
N$1054: C107.2 D130.2(-) IC117.2(TR) IC117.6(THR) R492.1
N$1055: IC117.5(CV) R493.2
N$1056: IC117.3(Q) IC118.12(B:A) R493.1
N$1057: D130.1(+) R494.1
N$1058: 21.10 D122.2(-) D123.2(-) JP55.1 SJ11.1 TP240.TP(PP)
N$1059: JP55.2 R495.2 R496.2 SJ11.2
N$1060: IC118.9(B:!Q) IC118.11(B:B) R499.2
N$1061: C109.1 IC118.14(B:T2) R497.1
N$1062: JP51.1 R498.2
N$1063: IC114.15(O2) R484.1
N$1064: 22.12 R499.1 TP253.TP(PP)
N$1065: D127.1(+) JP53.2
N$1066: D121.2(-) IC115.2(A:OUT) JP52.1 Q76.1(G) R491.2
N$1067: IC120.1(A:OUT) R500.2
N$1068: C110.1 R500.1 R501.1
N$1069: IC120.5(B:+IN) R501.2 R502.2
N$1070: IC120.6(B:-IN) R503.1 R504.2
N$1071: D128.1(+) JP54.1
N$1072: JP52.3 R489.1 R490.1
N$1073: IC115.13(D:OUT)
N$1074: R481.1 X31.21
N$1075: Q75.2(C) R481.2 R505.1
VCC: 6V10.TP(PP) C103.1 IC112.OUT IC115.3(P:V+) IC116.1(OUT) IC120.8(P:V+) R470.2 R473.2 R476.1 R483.2 R503.2 ; also sheet 1,2,3,4,5,6,7,8,9,10,12
Unconnected: IC111.4(Q7) IC111.5(Q9) IC111.7(Q6) IC111.9(Q8) IC117.7(DIS) IC118.2(A:T2) IC118.6(A:Q) IC118.7(A:!Q) IC118.10(B:Q) X31.20 X31.24

### Notes on the sheet
- Externe Beschaltung
- Variante "eine LED leuchtet"
- Variante "alle LEDs bis und
   mit Gang X leuchten"
- Anzeige:
- Klemmleisten
  Ausgang:
- Gang 1
- DauerPlus
  Konstant-Strom für LEDs
  Gang 1
  Gang 2
  Gang 3
  Gang 4
  Gang 5
  Neutrallampe
  Blinker rechts
  Blinker zusammen
  Blinker links
  Masse
- Gang 1
- Gang 2
- Gang 2
- Gang 3
- Gang 3
- Gang 1 | Gang 2 | Gang 3 | Gang 4 | Gang 5
- Gang 4
- Gang 4 | Klemmleisten Ausgang:
- Gang 5
- Gang 5
- Zündugsplus
  Choke
  Öldrucklampe
  Temperaturlampe
  Ladekontrolllampe
  Tankgeber (100hm)
  ABS-Lampe
  Lampentest
  Warnlampe
  Fernlichtlampe
  Geschwindigkeitssignal
  Menütaster
- Stromquelle für Gang
  LEDs. Für mehr als 12mA
  muss ein Widerstand "R_user"
  eingelötet werden. Für weniger
  muss der 1kOhm SMD Widerstand
  neben R_user entfernt werden
  I = 12V/1kOhm(default)+12V/R_user
  I= 12mA (default) + 12V/R_user
  Beispiel:
  R_user      Strom in LEDs
  1 kOhm     22-26mA
  ohne       11-13mA
- Externe Beschaltung
- an Zündungsplus anhängen
  (Neutral leuchtet wenn Gang 0
  eingelegt und Zündschlüssel steckt )
- Neutrallampe
  für eigene
  Ganganzeige
- DauerPlus Batterie 12V (rot weiss)
  Ganganzeige Signal C (gelb weiss)
  Ganganzeige Signal B (gelb schwarz)
  Ganganzeige Signal A (gelb dunkelblau)
  12V/350mA zum Starknopf (schwarz grün)
  Zündungsplus 12V (grün schwarz)
  Reservelampe (weiss)
  ABS Leuchte (blau)
  Ladekontrollleuchte (schaltet auf Masse) (violett schwarz)
  Temperaturleuchte (schaltet auf Masse) (braun schwarz)
  Öldruckleuchte (schaltet auf Masse) (braun grün)
  Chokelampe (schaltet auf Masse) (violett weiss)
- BL resistors
- 1k
- an Ausgang "Neutrallampe" anhängen
- Masse (braun)
  Lampentest (schaltet auf Masse)(weiss blau)
  Fernlichtlampe (12V) (weiss)
  Drehzahl Zündspule (schwarz blau)
  Blinker rechts (blau scharz)
  Masse (braun)
  Blinker links (blau rot)
  nicht angeschlossen
  Tachosiganl zum Blinrelais (balu grün)
  Tachogeber (gelb)
  Masse Tachobeger (braun)
  Tachobeleuchtung (12V Zündungsplus) (grau blau)
- RES | BAR
- 4.7V | rising edge trigger A
- ZündungsPlus
- current source 96mA
- 6V regulated for Opamps
- nicht bestückt

## Sheet 12 of 12
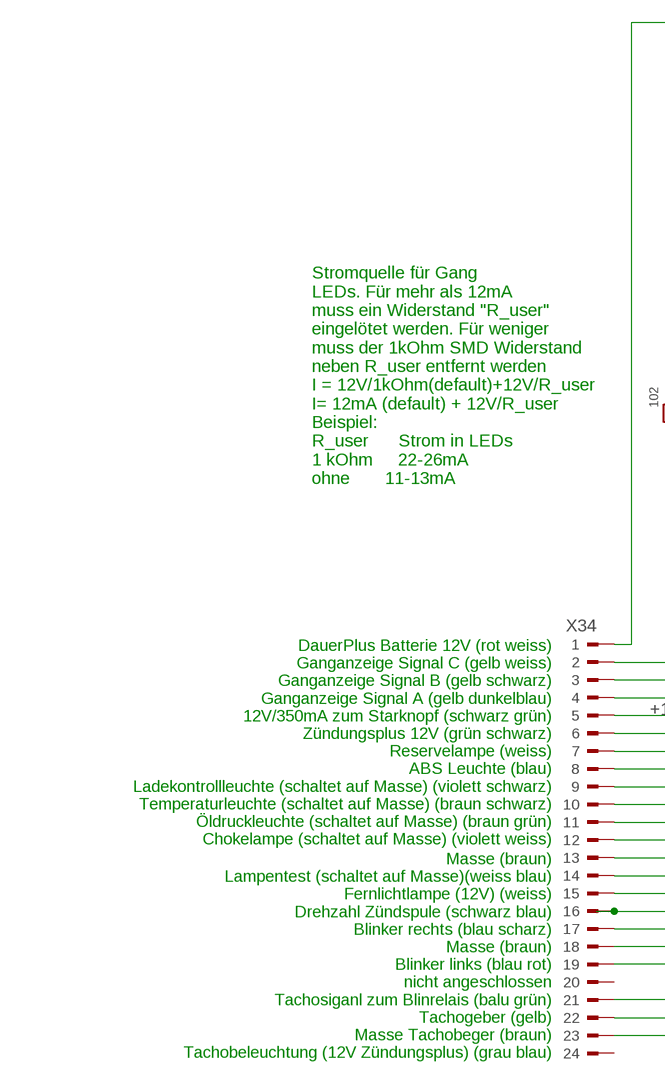
[diagram p22: schematic, sheet 12, part 1 of 2]
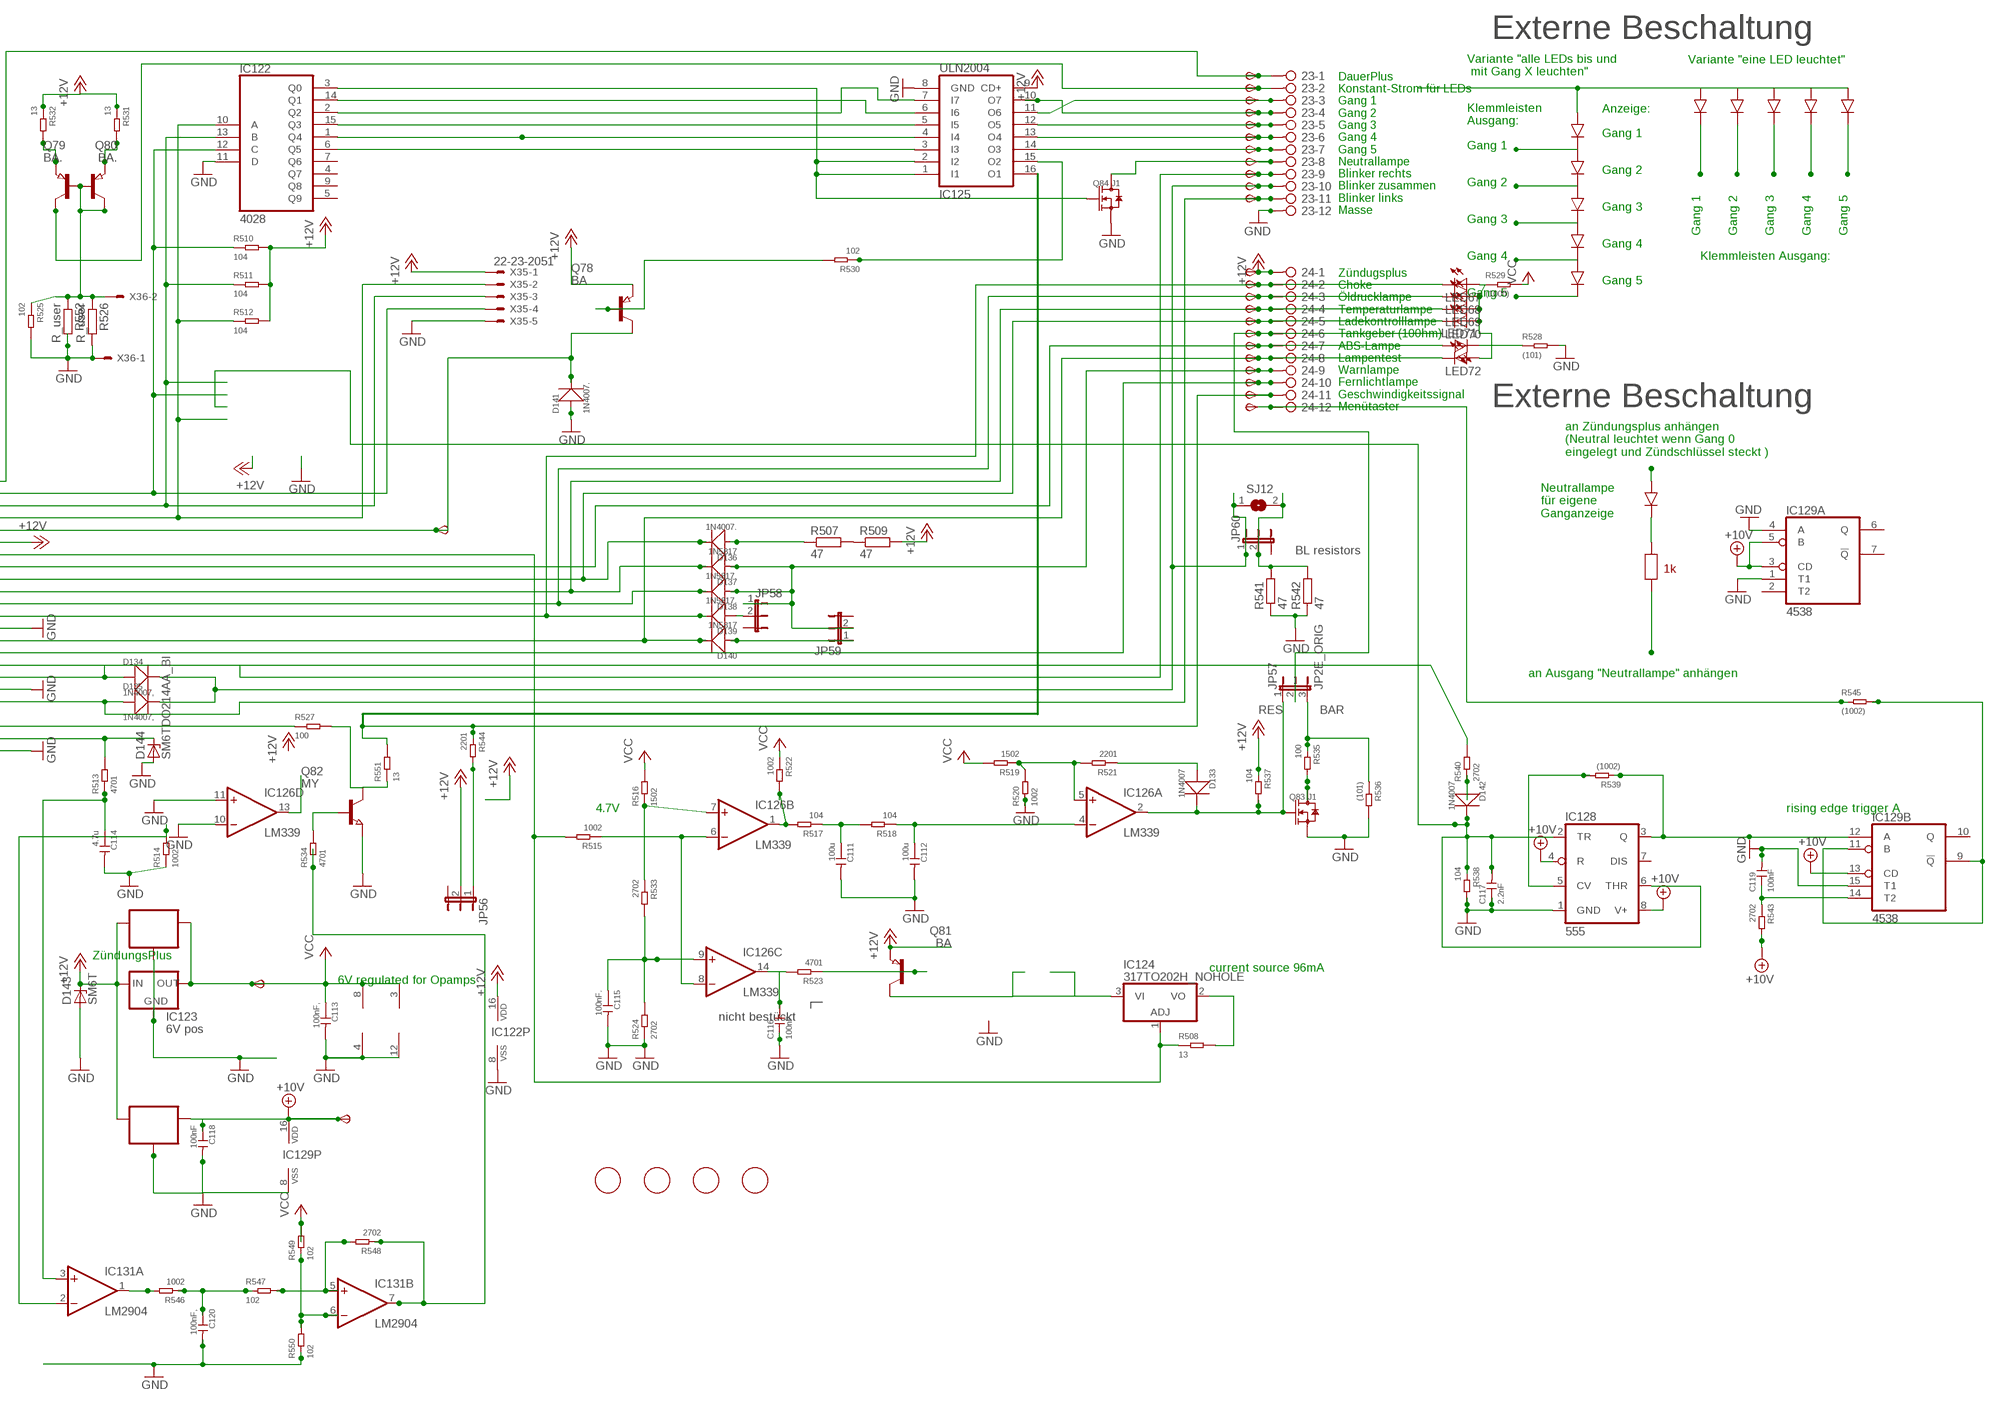
[diagram p23: schematic, sheet 12, part 2 of 2]

### Parts
6V11  TPSB2.0  [B2.0]
10V11  TPSB2.0  [B2.0]
23  2081-1132  [12-PIN]
24  2081-1132  [12-PIN]
C111  100u  CERAMIC-100UF-6.3V-20%-X5R(1206)  [C1206]
C112  100u  CERAMIC-100UF-6.3V-20%-X5R(1206)  [C1206]
C113  100nF,  CERAMIC-100NF-50V-10%-X7R(0805)  [C0805]
C114  4.7u  CERAMIC-4.7UF-25V-10%-X5R(0805)  [C0805]
C115  100nF.  CERAMIC-100NF-50V-10%-X7R(0805)  [C0805]
C116  100nF.  CERAMIC-100NF-50V-10%-X7R(0805)  [C0805]
C117  2.2nF  CERAMIC-100NF-50V-10%-X7R(0805)  [C0805]
C118  100nF  CERAMIC-100NF-50V-10%-X7R(0805)  [C0805]
C119  100nF  CERAMIC-100NF-50V-10%-X7R(0805)  [C0805]
C120  100nF,  CERAMIC-100NF-50V-10%-X7R(0805)  [C0805]
D133  1N4007  DIODE-GEN-PURPOSE-1KV-1A(DO-214AC)  [DO-214AC]
D134  1N4007,  DIODE-GEN-PURPOSE-1KV-1A(DO-214AC)  [DO-214AC]
D135  1N4007,  DIODE-GEN-PURPOSE-1KV-1A(DO-214AC)  [DO-214AC]
D136  1N4007.  DIODE-GEN-PURPOSE-1KV-1A(DO-214AC)  [DO-214AC]
D137  1N5817  DIODE-GEN-PURPOSE-1KV-1A(DO-214AC)DO-214AC/1206  [DO-214AC_SLIM]
D138  1N5817.  DIODE-GEN-PURPOSE-1KV-1A(DO-214AC)DO-214AC/1206  [DO-214AC_SLIM]
D139  1N5817.  DIODE-GEN-PURPOSE-1KV-1A(DO-214AC)DO-214AC/1206  [DO-214AC_SLIM]
D140  1N5817  DIODE-GEN-PURPOSE-1KV-1A(DO-214AC)DO-214AC/1206  [DO-214AC_SLIM]
D141  1N4007.  DIODE-GEN-PURPOSE-1KV-1A(DO-214AC)  [DO-214AC]
D142  1N4007  DIODE-GEN-PURPOSE-1KV-1A(DO-214AC)  [DO-214AC]
D143  SM6T  [DO214AA]
D144  SM6TDO214AA_BI  [DO214AA_BI]
FID45  FIDUCIAL  [FIDUCIAL_1MM]
FID46  FIDUCIAL  [FIDUCIAL_1MM]
FID47  FIDUCIAL  [FIDUCIAL_1MM]
FID48  FIDUCIAL  [FIDUCIAL_1MM]
IC122  4028  4028D  [SO16]
IC123  6V pos  78LXX  [78LXX]
IC124  317TO202H_NOHOLE  [TO220H_NOHOLE]
IC125  ULN2004  ULN2004AD  [SO16]
IC126  LM339  LM339D  [SO14]
IC127  78L06  78LXXSOT89_ROUND  [SOT89_ROUND]
IC128  555  NE555D  [SO08]
IC129  4538  4538D  [SO16]
IC130  78L10  78LXXSOT89_ROUND  [SOT89_ROUND]
IC131  LM2904  LM358D  [SO08]
JP56  JP2EJP2_SMALLPADS  [JP2_SMALLPADS]
JP57  JP2E_ORIG  [JP2_ORIG_SMALLPADS]
JP58  JP2EJP2_SMALLPADS  [JP2_SMALLPADS]
JP59  JP2EJP2_SMALLPADS  [JP2_SMALLPADS]
JP60  JP2EJP2_SMALLPADS  [JP2_SMALLPADS]
LED67  LEDLD260  [LD260]
LED68  LEDLD260  [LD260]
LED69  LEDLD260  [LD260]
LED70  LEDLD260  [LD260]
LED71  LEDLD260  [LD260]
LED72  LEDLD260  [LD260]
Q78  BA  PNP-TRANSISTOR_SOT89  [SOT89]
Q79  BA.  PNP-TRANSISTOR_SOT89  [SOT89]
Q80  BA.  PNP-TRANSISTOR_SOT89  [SOT89]
Q81  BA  PNP-TRANSISTOR_SOT89  [SOT89]
Q82  MY  NPN-TRANSISTOR_SOT89  [SOT89]
Q83  J1  SMD-MOSFET-N-CH-50V-200MA-BSS138W-7-F(SOT-23)  [SOT-23]
Q84  J1  SMD-MOSFET-N-CH-50V-200MA-BSS138W-7-F(SOT-23)  [SOT-23]
R507  47  R-EU_V235/17_1MM  [V235/17_1MM]
R508  13  SMD-RES-13R-5%-1/4W(1206)  [R1206]
R509  47  R-EU_V235/17_1MM  [V235/17_1MM]
R510  104  SMD-RES-10K-1%-1/8W(0805)  [R0805]
R511  104  SMD-RES-10K-1%-1/8W(0805)  [R0805]
R512  104  SMD-RES-10K-1%-1/8W(0805)  [R0805]
R513  4701  SMD-RES-4.7K-5%-1/8W(0805)  [R0805]
R514  1002  SMD-RES-10K-1%-1/8W(0805)  [R0805]
R515  1002  SMD-RES-10K-1%-1/8W(0805)  [R0805]
R516  1502  SMD-RES-10K-1%-1/8W(0805)  [R0805]
R517  104  SMD-RES-10K-1%-1/8W(0805)  [R0805]
R518  104  SMD-RES-10K-1%-1/8W(0805)  [R0805]
R519  1502  SMD-RES-10K-1%-1/8W(0805)  [R0805]
R520  1002  SMD-RES-10K-1%-1/8W(0805)  [R0805]
R521  2201  SMD-RES-2.2K-5%-1/8W(0805)  [R0805]
R522  1002  SMD-RES-10K-1%-1/8W(0805)  [R0805]
R523  4701  SMD-RES-4.7K-5%-1/8W(0805)  [R0805]
R524  2702  SMD-RES-4.7K-5%-1/8W(0805)  [R0805]
R525  102  SMD-RES-1K-5%-1/8W(0805)  [R0805]
R526  R_user  R-EU_R0805  [R0805]
R527  100  SMD-RES-220R-5%-1/8W(0805)  [R0805]
R528  (101)  SMD-RES-100R-5%-1/8W(0805)  [R0805]
R529  (1000)  SMD-RES-100R-5%-1/8W(0805)  [R0805]
R530  102  SMD-RES-1K-5%-1/8W(0805)  [R0805]
R531  13  SMD-RES-13R-5%-1/4W(1206)  [R1206]
R532  13  SMD-RES-13R-5%-1/4W(1206)  [R1206]
R533  2702  SMD-RES-4.7K-5%-1/8W(0805)  [R0805]
R534  4701  SMD-RES-4.7K-5%-1/8W(0805)  [R0805]
R535  100  SMD-RES-2.2K-5%-1/8W(0805)  [R0805]
R536  (101)  SMD-RES-2.2K-5%-1/8W(0805)  [R0805]
R537  104  SMD-RES-10K-1%-1/8W(0805)  [R0805]
R538  104  SMD-RES-10K-1%-1/8W(0805)  [R0805]
R539  (1002)  SMD-RES-10K-1%-1/8W(0805)  [R0805]
R540  2702  SMD-RES-10K-1%-1/8W(0805)  [R0805]
R541  47  R-EU_V235/17_1MM  [V235/17_1MM]
R542  47  R-EU_V235/17_1MM  [V235/17_1MM]
R543  2702  SMD-RES-4.7K-5%-1/8W(0805)  [R0805]
R544  2201  SMD-RES-2.2K-5%-1/8W(0805)  [R0805]
R545  (1002)  SMD-RES-4.7K-5%-1/8W(0805)  [R0805]
R546  1002  SMD-RES-10K-1%-1/8W(0805)  [R0805]
R547  102  SMD-RES-1K-5%-1/8W(0805)  [R0805]
R548  2702  SMD-RES-4.7K-5%-1/8W(0805)  [R0805]
R549  102  SMD-RES-1K-5%-1/8W(0805)  [R0805]
R550  102  SMD-RES-1K-5%-1/8W(0805)  [R0805]
R551  13  SMD-RES-13R-5%-1/4W(1206)  [R1206]
R552  R_user  R-EU_R0805  [R0805]
SJ12  SJ  [SJ]
START11  TPSB2.0  [B2.0]
TP254  TPSB2.0  [B2.0]
TP255  TPSB2.0  [B2.0]
TP256  TPSB2.0  [B2.0]
TP257  TPSB2.0  [B2.0]
TP258  TPSB2.0  [B2.0]
TP259  TPSB2.0  [B2.0]
TP260  TPSB2.0  [B2.0]
TP261  TPSB2.0  [B2.0]
TP262  TPSB2.0  [B2.0]
TP263  TPSB2.0  [B2.0]
TP264  TPSB2.0  [B2.0]
TP265  TPSB2.0  [B2.0]
TP266  TPSB2.0  [B2.0]
TP267  TPSB2.0  [B2.0]
TP268  TPSB2.0  [B2.0]
TP269  TPSB2.0  [B2.0]
TP270  TPSB2.0  [B2.0]
TP271  TPSB2.0  [B2.0]
TP272  TPSB1,27  [B1,27]
TP273  TPSB2.0  [B2.0]
TP274  TPSB2.0  [B2.0]
TP275  TPSB2.0  [B2.0]
TP276  TPSB2.0  [B2.0]
X34  CON_BMWV2  [24-PIN_V2]
X35  22-23-2051  [22-23-2051]
X36  22-23-2021  [22-23-2021]

### Nets
+10V: 10V11.TP(PP) C118.1 IC128.4(R) IC128.8(V+) IC129.3(A:CD) IC129.5(A:B) IC129.13(B:CD) IC129.16(P:VDD) IC130.1(OUT) R543.2 ; also sheet 1,2,3,4,5,6,7,8,9,10,11
+12V: 24.1 D143.C IC122.16(VDD) IC123.IN IC125.9(CD+) IC127.3(IN) IC130.3(IN) JP56.2 Q78.3(E) Q81.3(E) R509.2 R510.2 R511.2 R512.2 R531.1 R532.1 R537.1 TP275.TP(PP) X34.6 X35.1 ; also sheet 1,2,3,4,5,6,7,8,9,10,11
+12V12: IC131.7(B:OUT) R534.1 R548.1
GND: 23.12 C111.2 C112.2 C113.2 C114.2 C115.2 C116.1 C117.1 C118.2 C119.2 C120.2 D141.1(+) D143.A D144.A IC122.8(VSS) IC122.11(D) IC123.GND IC125.8(GND) IC126.10(D:-IN) IC126.11(D:+IN) IC126.12(P:GND) IC127.2(GND) IC127.2@1(GND) IC128.1(GND) IC129.1(A:T1) IC129.4(A:A) IC129.8(P:VSS) IC129.15(B:T1) IC130.2(GND) IC130.2@1(GND) IC131.4(P:V-) Q82.3(E) Q83.2(S) Q84.2(S) R514.1 R520.1 R524.1 R525.2 R526.2 R528.2 R536.2 R538.2 R541.1 R542.1 R550.1 R552.2 X34.13 X34.18 X34.23 X35.5 X36.1 ; also sheet 1,2,3,4,5,6,7,8,9,10,11
N$1076: R507.2 R509.1
N$1077: 24.9 D137.1(+) D138.1(+) JP58.1 JP59.2 TP272.TP(PP)
N$1078: IC122.10(A) R512.1 X34.4 X35.2
N$1079: IC122.13(B) R511.1 X34.3 X35.3
N$1080: D141.2(-) Q78.2(C) START11.TP(PP) X34.5
N$1081: IC122.12(C) R510.1 X34.2 X35.4
N$1082: 24.7 LED71.A TP270.TP(PP) X34.8
N$1083: 24.2 D139.2(-) LED67.K(C) TP265.TP(PP) X34.12
N$1084: 24.3 D138.2(-) LED68.K(C) TP266.TP(PP) X34.11
N$1085: 24.4 D137.2(-) LED69.K(C) TP267.TP(PP) X34.10
N$1086: 24.8 D140.2(-) LED72.K(C) TP271.TP(PP) X34.14
N$1087: 23.9 D134.1(+) TP262.TP(PP) X34.17
N$1088: 23.11 D135.1(+) TP264.TP(PP) X34.19
N$1089: D144.C R513.2 X34.22
N$1090: C114.1 IC131.3(A:+IN) R513.1
N$1091: 24.11 IC125.16(O1) R544.1 R551.2 TP274.TP(PP)
N$1092: IC126.1(B:OUT) R517.2 R522.2
N$1093: C111.1 R517.1 R518.2
N$1094: C112.1 IC126.4(A:-IN) R518.1
N$1095: IC126.5(A:+IN) R519.1 R520.2 R521.2
N$1096: D133.1(+) R521.1
N$1097: C115.1 IC126.9(C:+IN) R524.2 R533.2
N$1098: C116.2 IC126.14(C:OUT) R523.2
N$1099: Q81.1(B) R523.1
N$1100: IC122.2(Q2) IC125.7(I7)
N$1101: 23.5 IC125.12(O5) TP258.TP(PP)
N$1102: IC122.1(Q4) IC125.4(I4)
N$1103: 23.8 Q84.3(D) TP261.TP(PP)
N$1104: 24.10 TP273.TP(PP) X34.15
N$1105: 24.5 D136.2(-) LED70.K(C) TP268.TP(PP) X34.9
N$1106: D136.1(+) R507.1
N$1107: IC122.6(Q5) IC125.3(I3)
N$1108: 23.4 IC125.10(O7) TP257.TP(PP)
N$1109: IC124.1(ADJ) R508.1 R515.2 X34.7
N$1110: IC126.6(B:-IN) IC126.8(C:-IN) R515.1
N$1111: 23.2 Q80.2(C) TP255.TP(PP)
N$1112: 23.1 TP254.TP(PP) X34.1
N$1126: R540.2 X34.16
N$1127: IC122.15(Q3) IC125.5(I5)
N$1128: 23.6 IC125.13(O4) TP259.TP(PP)
N$1129: 23.7 IC125.14(O3) TP260.TP(PP)
N$1130: 24.6 JP57.2 TP269.TP(PP)
N$1131: LED71.K(C) R528.1
N$1132: LED67.A LED68.A LED69.A LED70.A LED72.A R529.1
N$1133: Q78.1(B) R530.2
N$1134: IC122.3(Q0) IC125.1(I1) IC125.2(I2) Q84.1(G)
N$1135: IC122.14(Q1) IC125.6(I6)
N$1136: 23.3 IC125.11(O6) TP256.TP(PP)
N$1137: Q79.1(B) Q79.2(C) Q80.1(B) R525.1 R526.1 R552.1 X36.2
N$1138: Q80.3(E) R532.2
N$1139: Q79.3(E) R531.2
N$1140: IC126.7(B:+IN) R516.1 R533.1
N$1141: IC131.2(A:-IN) R514.2
N$1142: Q82.1(B) R534.2
N$1143: Q83.3(D) R535.2
N$1144: IC124.2(VO) R508.2
N$1145: IC124.3(VI) Q81.2(C)
N$1146: C117.2 D142.2(-) IC128.2(TR) IC128.6(THR) R538.1
N$1147: IC128.5(CV) R539.2
N$1148: IC128.3(Q) IC129.12(B:A) R539.1
N$1149: D142.1(+) R540.1
N$1150: 23.10 D134.2(-) D135.2(-) JP60.1 SJ12.1 TP263.TP(PP)
N$1151: JP60.2 R541.2 R542.2 SJ12.2
N$1152: IC129.9(B:!Q) IC129.11(B:B) R545.2
N$1153: C119.1 IC129.14(B:T2) R543.1
N$1154: JP56.1 R544.2
N$1155: IC125.15(O2) R530.1
N$1156: 24.12 R545.1 TP276.TP(PP)
N$1157: D139.1(+) JP58.2
N$1158: D133.2(-) IC126.2(A:OUT) JP57.1 Q83.1(G) R537.2
N$1159: IC131.1(A:OUT) R546.2
N$1160: C120.1 R546.1 R547.1
N$1161: IC131.5(B:+IN) R547.2 R548.2
N$1162: IC131.6(B:-IN) R549.1 R550.2
N$1163: D140.1(+) JP59.1
N$1164: JP57.3 R535.1 R536.1
N$1165: IC126.13(D:OUT)
N$1166: R527.1 X34.21
N$1167: Q82.2(C) R527.2 R551.1
VCC: 6V11.TP(PP) C113.1 IC123.OUT IC126.3(P:V+) IC127.1(OUT) IC131.8(P:V+) R516.2 R519.2 R522.1 R529.2 R549.2 ; also sheet 1,2,3,4,5,6,7,8,9,10,11
Unconnected: IC122.4(Q7) IC122.5(Q9) IC122.7(Q6) IC122.9(Q8) IC128.7(DIS) IC129.2(A:T2) IC129.6(A:Q) IC129.7(A:!Q) IC129.10(B:Q) X34.20 X34.24

### Notes on the sheet
- Externe Beschaltung
- Variante "eine LED leuchtet"
- Variante "alle LEDs bis und
   mit Gang X leuchten"
- Anzeige:
- Klemmleisten
  Ausgang:
- Gang 1
- DauerPlus
  Konstant-Strom für LEDs
  Gang 1
  Gang 2
  Gang 3
  Gang 4
  Gang 5
  Neutrallampe
  Blinker rechts
  Blinker zusammen
  Blinker links
  Masse
- Gang 1
- Gang 2
- Gang 2
- Gang 3
- Gang 3
- Gang 1 | Gang 2 | Gang 3 | Gang 4 | Gang 5
- Gang 4
- Gang 4 | Klemmleisten Ausgang:
- Gang 5
- Gang 5
- Zündugsplus
  Choke
  Öldrucklampe
  Temperaturlampe
  Ladekontrolllampe
  Tankgeber (100hm)
  ABS-Lampe
  Lampentest
  Warnlampe
  Fernlichtlampe
  Geschwindigkeitssignal
  Menütaster
- Stromquelle für Gang
  LEDs. Für mehr als 12mA
  muss ein Widerstand "R_user"
  eingelötet werden. Für weniger
  muss der 1kOhm SMD Widerstand
  neben R_user entfernt werden
  I = 12V/1kOhm(default)+12V/R_user
  I= 12mA (default) + 12V/R_user
  Beispiel:
  R_user      Strom in LEDs
  1 kOhm     22-26mA
  ohne       11-13mA
- Externe Beschaltung
- an Zündungsplus anhängen
  (Neutral leuchtet wenn Gang 0
  eingelegt und Zündschlüssel steckt )
- Neutrallampe
  für eigene
  Ganganzeige
- DauerPlus Batterie 12V (rot weiss)
  Ganganzeige Signal C (gelb weiss)
  Ganganzeige Signal B (gelb schwarz)
  Ganganzeige Signal A (gelb dunkelblau)
  12V/350mA zum Starknopf (schwarz grün)
  Zündungsplus 12V (grün schwarz)
  Reservelampe (weiss)
  ABS Leuchte (blau)
  Ladekontrollleuchte (schaltet auf Masse) (violett schwarz)
  Temperaturleuchte (schaltet auf Masse) (braun schwarz)
  Öldruckleuchte (schaltet auf Masse) (braun grün)
  Chokelampe (schaltet auf Masse) (violett weiss)
- BL resistors
- 1k
- an Ausgang "Neutrallampe" anhängen
- Masse (braun)
  Lampentest (schaltet auf Masse)(weiss blau)
  Fernlichtlampe (12V) (weiss)
  Drehzahl Zündspule (schwarz blau)
  Blinker rechts (blau scharz)
  Masse (braun)
  Blinker links (blau rot)
  nicht angeschlossen
  Tachosiganl zum Blinrelais (balu grün)
  Tachogeber (gelb)
  Masse Tachobeger (braun)
  Tachobeleuchtung (12V Zündungsplus) (grau blau)
- RES | BAR
- 4.7V | rising edge trigger A
- ZündungsPlus
- current source 96mA
- 6V regulated for Opamps
- nicht bestückt